# Altium project DDS_RIKEN_2014.PrjPcb
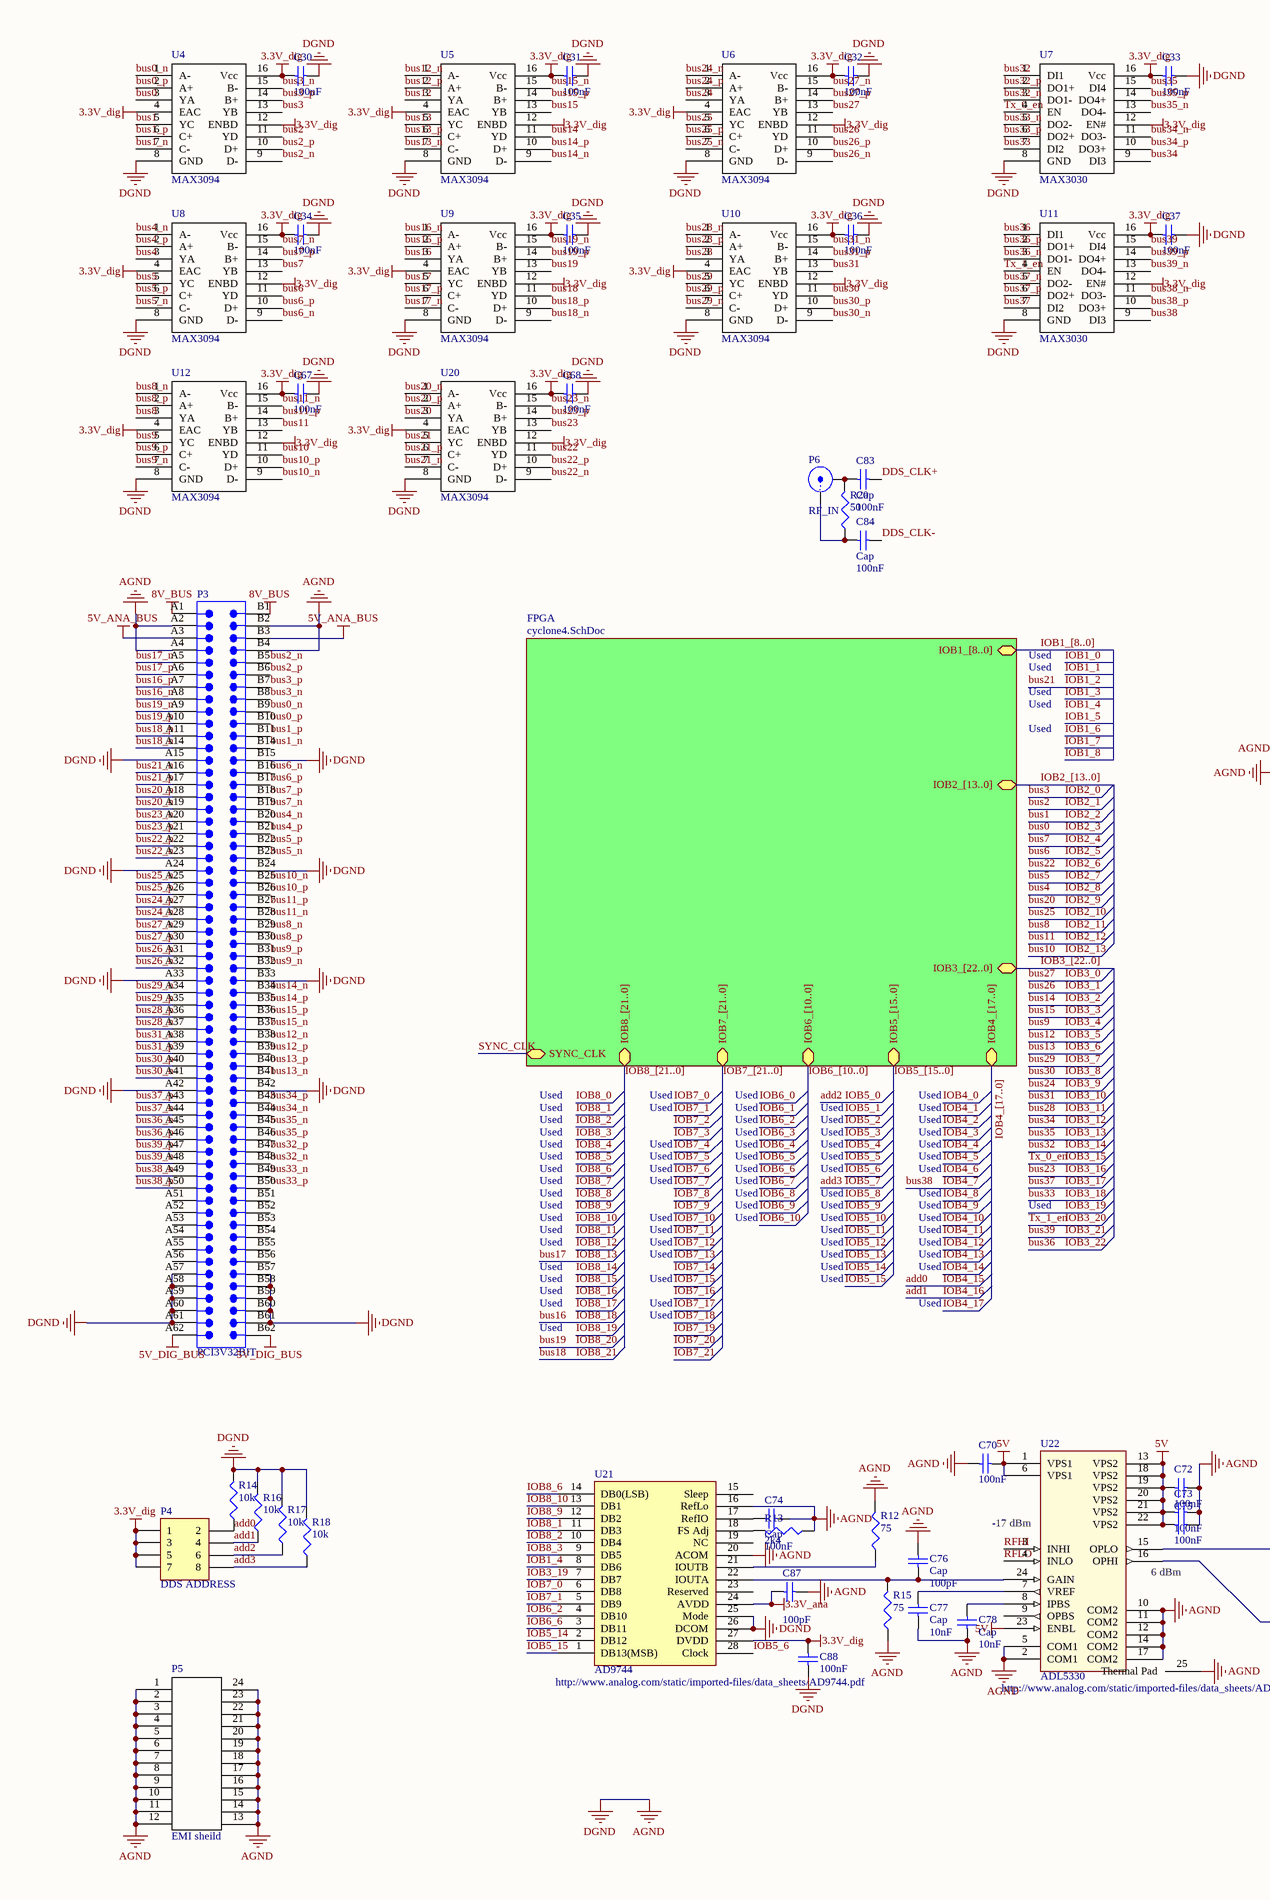
[diagram p0: DDS_RIKEN_main.SchDoc, left]
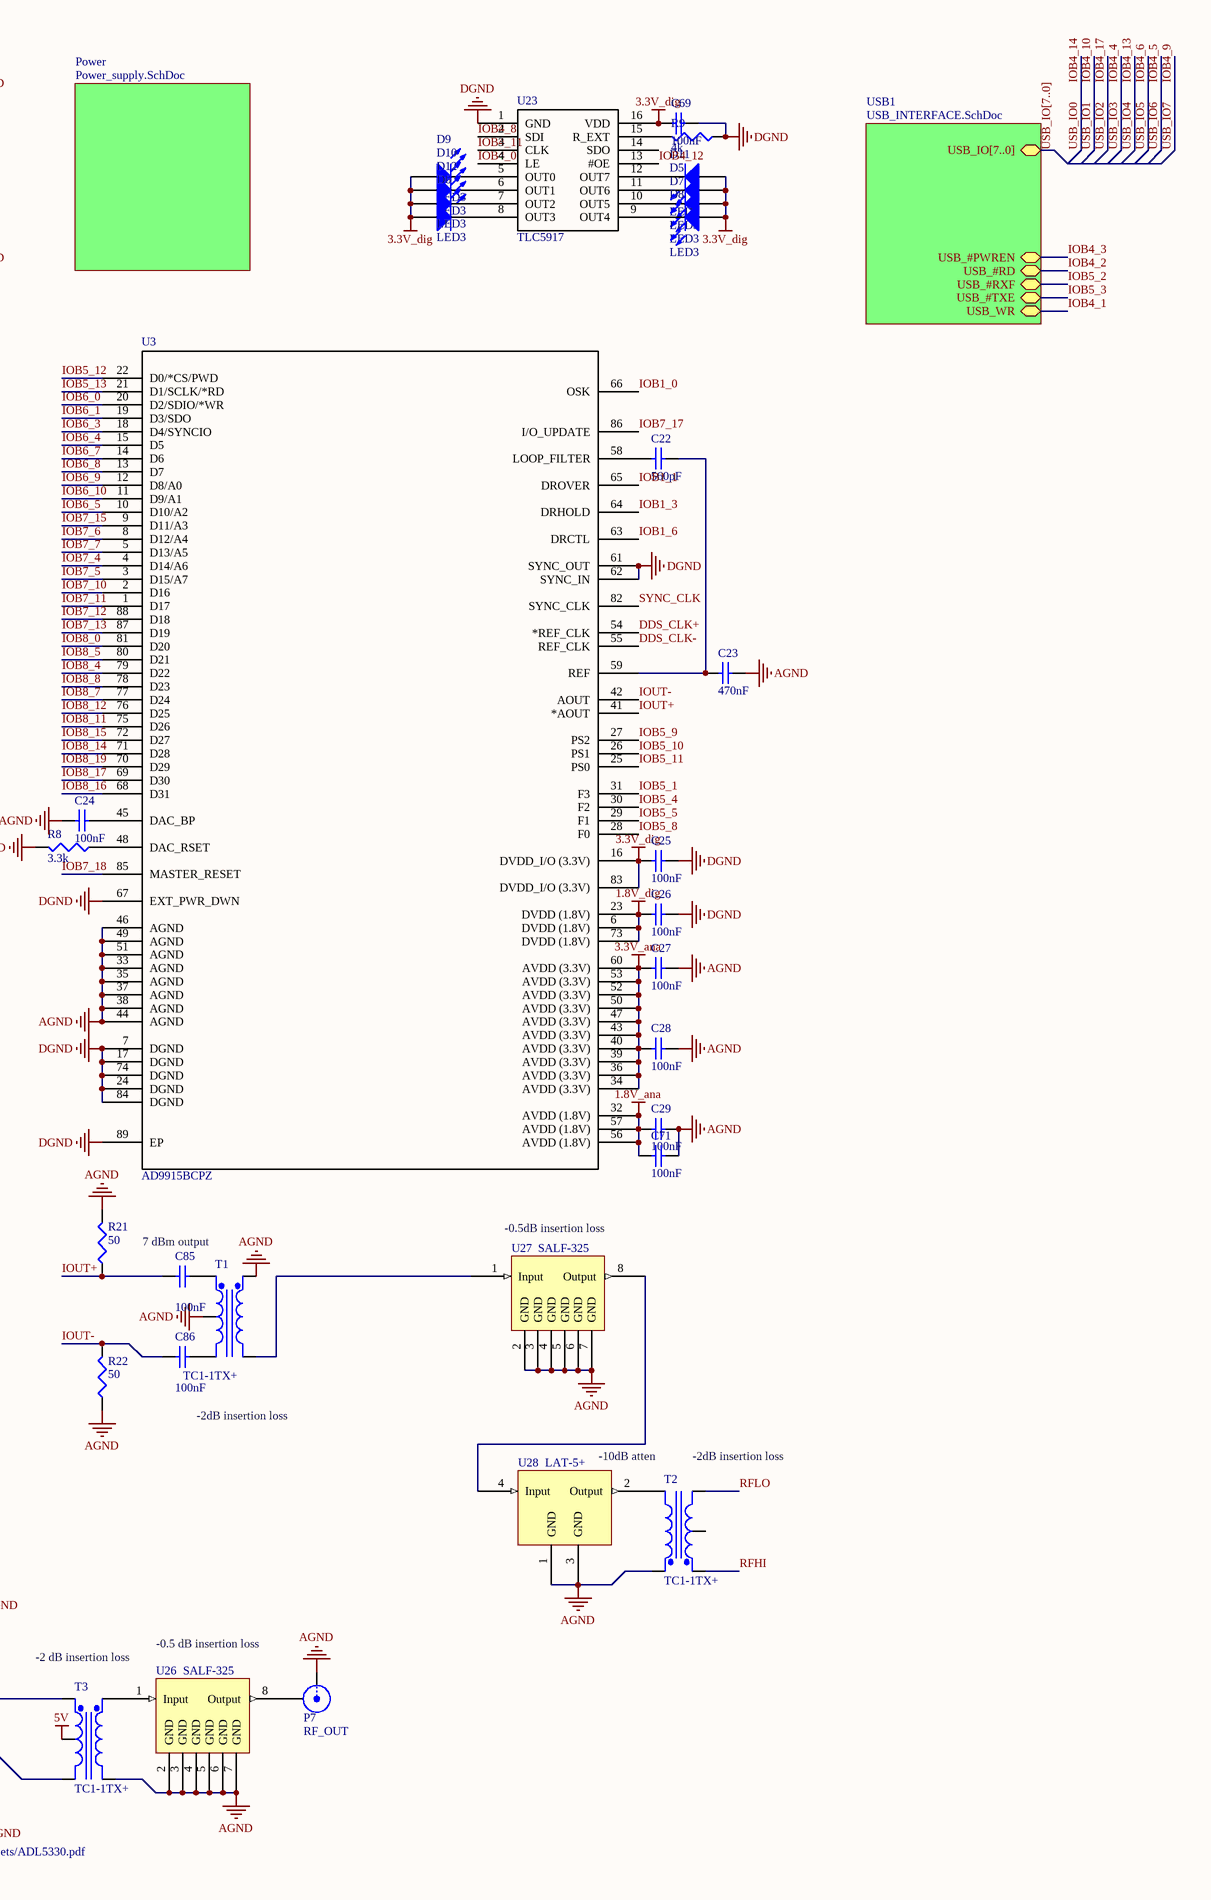
[diagram p1: DDS_RIKEN_main.SchDoc, right]
3 sheets, 159 parts. Net scope: hierarchical (ports join the sheet entries above them; power ports are global).
Board file: DDS_RIKEN_2014.PcbDoc
Sheets:
  DDS_RIKEN_main.SchDoc
    FPGA = cyclone4.SchDoc
    Power = Power_supply.SchDoc

## Sheet DDS_RIKEN_main.SchDoc
size 508 x 406 mm

### Parts
C22  value 560pF  [CAPC2012L]  (hidden comment: Cap Semi)
C23  value 470nF  [CAPC2012L]  (hidden comment: Cap Semi)
C24  value 100nF  [CAPC2012L]  (hidden comment: Cap Semi)
C25  value 100nF  [CAPC2012L]  (hidden comment: Cap Semi)
C26  value 100nF  [CAPC2012L]  (hidden comment: Cap Semi)
C27  value 100nF  [CAPC2012L]  (hidden comment: Cap Semi)
C28  value 100nF  [CAPC2012L]  (hidden comment: Cap Semi)
C29  value 100nF  [CAPC2012L]  (hidden comment: Cap Semi)
C30  value 100nF  [CAPC2012L]  (hidden comment: Cap Semi)
C31  value 100nF  [CAPC2012L]  (hidden comment: Cap Semi)
C32  value 100nF  [CAPC2012L]  (hidden comment: Cap Semi)
C33  value 100nF  [CAPC2012L]  (hidden comment: Cap Semi)
C34  value 100nF  [CAPC2012L]  (hidden comment: Cap Semi)
C35  value 100nF  [CAPC2012L]  (hidden comment: Cap Semi)
C36  value 100nF  [CAPC2012L]  (hidden comment: Cap Semi)
C37  value 100nF  [CAPC2012L]  (hidden comment: Cap Semi)
C67  value 100nF  [CAPC2012L]  (hidden comment: Cap Semi)
C68  value 100nF  [CAPC2012L]  (hidden comment: Cap Semi)
C69  value 100nF  [CAPC2012L]  (hidden comment: Cap Semi)
C70  value 100nF  [CAPC2012L]  (hidden comment: Cap Semi)
C71  value 100nF  [CAPC2012L]  (hidden comment: Cap Semi)
C72  value 100nF  [CAPC2012L]  (hidden comment: Cap Semi)
C73  value 100nF  [CAPC2012L]  (hidden comment: Cap Semi)
C74  Cap  value 100nF  [c0805]
C75  value 100nF  [CAPC2012L]  (hidden comment: Cap Semi)
C76  Cap  value 100pF  [c0805]
C77  Cap  value 10nF  [c0805]
C78  Cap  value 10nF  [c0805]
C83  Cap  value 100nF  [c0805]
C84  Cap  value 100nF  [c0805]
C85  value 100nF  [c0805]  (hidden comment: Cap)
C86  value 100nF  [c0805]  (hidden comment: Cap)
C87  value 100pF  [c0805]  (hidden comment: Cap)
C88  value 100nF  [c0805]  (hidden comment: Cap)
D5  LED3  [DSO-C2/D5.6]
D6  LED3  [DSO-C2/D5.6]
D7  LED3  [DSO-C2/D5.6]
D8  LED3  [DSO-C2/D5.6]
D9  LED3  [DSO-C2/D5.6]
D10  LED3  [DSO-C2/D5.6]
D11  LED3  [DSO-C2/D5.6]
D12  LED3  [DSO-C2/D5.6]
P3  PCI3V32BIT  [PCI3V32BIT]
P4  DDS ADDRESS  [HDR2X4]
P5  EMI sheild  [BMIS-207]
P6  RF_IN  [SMA_Edgecon_31milthick]
P7  RF_OUT  [SMA_Edgecon_31milthick]
R8  value 3.3k  [RESC3216L]
R9  value 4k  [RESC3216L]
R12  value 75  [RESC3216L]
R13  value 2k4  [RESC3216L]
R14  value 10k  [RESC3216L]
R15  value 75  [RESC3216L]
R16  value 10k  [RESC3216L]
R17  value 10k  [RESC3216L]
R18  value 10k  [RESC3216L]
R20  value 50  [RESC3216L]
R21  value 50  [RESC3216L]
R22  value 50  [RESC3216L]
T1  TC1-1TX+  [TC1-1T+]
T2  TC1-1TX+  [TC1-1T+]
T3  TC1-1TX+  [TC1-1T+]
U3  AD9915BCPZ  [CP_88_5]
U4  MAX3094  [TSSOP16]
U5  MAX3094  [TSSOP16]
U6  MAX3094  [TSSOP16]
U7  MAX3030  [TSSOP16]
U8  MAX3094  [TSSOP16]
U9  MAX3094  [TSSOP16]
U10  MAX3094  [TSSOP16]
U11  MAX3030  [TSSOP16]
U12  MAX3094  [TSSOP16]
U20  MAX3094  [TSSOP16]
U21  AD9744  [TSOP65P640-28AM]
U22  ADL5330  [QFN50P400X400-24VAN]
U23  TLC5917  [D016_N]
U26  SALF-325  [SALF-325]
U27  SALF-325  [SALF-325]
U28  LAT-5+  [LAT-10+]

### Sub-sheets
FPGA = cyclone4.SchDoc: IOB1_[8..0], IOB2_[13..0], IOB3_[22..0], IOB4_[17..0], IOB5_[15..0], IOB6_[10..0], IOB7_[21..0], IOB8_[21..0], SYNC_CLK
Power = Power_supply.SchDoc: no entries
USB1 = USB_INTERFACE.SchDoc (file not in this document): USB_IO[7..0], USB_#PWREN, USB_#RD, USB_#RXF, USB_#TXE, USB_WR

### Nets
1.8V_ana: C29.1 C71.1 U3.32(AVDD_(1.8V)) U3.56(AVDD_(1.8V)) U3.57(AVDD_(1.8V))
1.8V_dig: C26.1 U3.6(DVDD_(1.8V)) U3.23(DVDD_(1.8V)) U3.73(DVDD_(1.8V))
3.3V_ana: C27.1 C28.1 C87.2 U3.34(AVDD_(3.3V)) U3.36(AVDD_(3.3V)) U3.39(AVDD_(3.3V)) U3.40(AVDD_(3.3V)) U3.43(AVDD_(3.3V)) U3.47(AVDD_(3.3V)) U3.50(AVDD_(3.3V)) U3.52(AVDD_(3.3V)) U3.53(AVDD_(3.3V)) U3.60(AVDD_(3.3V)) U21.24(AVDD)
3.3V_dig: C25.1 C30.1 C31.1 C32.1 C33.1 C34.1 C35.1 C36.1 C37.1 C67.1 C68.1 C69.1 C88.1 D5.1(A) D6.1(A) D7.1(A) D8.1(A) D9.1(A) D10.1(A) D11.1(A) D12.1(A) P4.1 P4.3 P4.5 P4.7 U3.16(DVDD_I/O_(3.3V)) U3.83(DVDD_I/O_(3.3V)) U4.4(EAC) U4.12(ENBD) U4.16(Vcc) U5.4(EAC) U5.12(ENBD) U5.16(Vcc) U6.4(EAC) U6.12(ENBD) U6.16(Vcc) U7.12(EN#) U7.16(Vcc) U8.4(EAC) U8.12(ENBD) U8.16(Vcc) U9.4(EAC) U9.12(ENBD) U9.16(Vcc) U10.4(EAC) U10.12(ENBD) U10.16(Vcc) U11.12(EN#) U11.16(Vcc) U12.4(EAC) U12.12(ENBD) U12.16(Vcc) U20.4(EAC) U20.12(ENBD) U20.16(Vcc) U21.27(DVDD) U23.16(VDD)
5V: C70.2 C72.1 C73.1 C75.1 T3.2(SecCT) U22.1(VPS1) U22.6(VPS1) U22.13(VPS2) U22.18(VPS2) U22.19(VPS2) U22.20(VPS2) U22.21(VPS2) U22.22(VPS2) U22.23(ENBL)
5V_ANA_BUS: P3.A3 P3.B3
5V_DIG_BUS: P3.A62 P3.B62
8V_BUS: P3.A1 P3.B1
AGND: C23.2 C24.1 C25.2 C26.2 C27.2 C28.2 C29.2 C30.2 C31.2 C32.2 C33.2 C34.2 C35.2 C36.2 C37.2 C67.2 C68.2 C69.2 C70.1 C71.2 C72.2 C73.2 C74.1 C75.2 C76.2 C77.1 C78.1 C87.1 C88.2 P3.A2 P3.A4 P3.A15 P3.A24 P3.A33 P3.A42 P3.A57 P3.A58 P3.A59 P3.A60 P3.A61 P3.B2 P3.B4 P3.B15 P3.B24 P3.B33 P3.B42 P3.B57 P3.B58 P3.B59 P3.B60 P3.B61 P5.1 P5.2(A10) P5.3(A11) P5.4(A12) P5.5(A13) P5.6(A14) P5.7(A15) P5.8(A16) P5.9(A17) P5.10(A18) P5.11(A26) P5.12(A25) P5.13(A23) P5.14(A24) P5.15(A22) P5.16(A19) P5.17(A20) P5.18(A21) P5.19(A8) P5.20(A7) P5.21(A6) P5.22(A5) P5.23(A4) P5.24(A3) P7.1(X) R8.2 R9.1 R12.2 R13.1 R14.2 R15.1 R16.2 R17.2 R18.2 R21.2 R22.1 T1.2(SecCT) T1.6(Pri+) T2.6(Pri+) T3.4(Pri-) U3.7(DGND) U3.17(DGND) U3.24(DGND) U3.33(AGND) U3.35(AGND) U3.37(AGND) U3.38(AGND) U3.44(AGND) U3.46(AGND) U3.49(AGND) U3.51(AGND) U3.61(SYNC_OUT) U3.62(SYNC_IN) U3.67(EXT_PWR_DWN) U3.74(DGND) U3.84(DGND) U3.89(EP) U4.8(GND) U5.8(GND) U6.8(GND) U7.8(GND) U8.8(GND) U9.8(GND) U10.8(GND) U11.8(GND) U12.8(GND) U20.8(GND) U21.16(RefLo) U21.20(ACOM) U21.25(Mode) U21.26(DCOM) U22.2(COM1) U22.5(COM1) U22.10(COM2) U22.11(COM2) U22.12(COM2) U22.14(COM2) U22.17(COM2) U22.25(Thermal_Pad) U23.1(GND) U26.2(GND) U26.3(GND) U26.4(GND) U26.5(GND) U26.6(GND) U26.7(GND) U27.2(GND) U27.3(GND) U27.4(GND) U27.5(GND) U27.6(GND) U27.7(GND) U28.1(GND) U28.3(GND)  [also labelled DGND]
add0: P4.2 R14.1  [also labelled IOB4_15]
add1: P4.4 R16.1  [also labelled IOB4_16]
add2: P4.6 R17.1  [also labelled IOB5_0]
add3: P4.8 R18.1  [also labelled IOB5_7]
bus0: U4.3(YA)  [also labelled IOB2_3]
bus0_n: P3.B9 U4.1(A-)
bus0_p: P3.B10 U4.2(A+)
bus1: U4.5(YC)  [also labelled IOB2_2]
bus1_n: P3.B14 U4.7(C-)
bus1_p: P3.B11 U4.6(C+)
bus2: U4.11(YD)  [also labelled IOB2_1]
bus2_n: P3.B5 U4.9(D-)
bus2_p: P3.B6 U4.10(D+)
bus3: U4.13(YB)  [also labelled IOB2_0]
bus3_n: P3.B8 U4.15(B-)
bus3_p: P3.B7 U4.14(B+)
bus4: U8.3(YA)  [also labelled IOB2_8]
bus4_n: P3.B20 U8.1(A-)
bus4_p: P3.B21 U8.2(A+)
bus5: U8.5(YC)  [also labelled IOB2_7]
bus5_n: P3.B23 U8.7(C-)
bus5_p: P3.B22 U8.6(C+)
bus6: U8.11(YD)  [also labelled IOB2_5]
bus6_n: P3.B16 U8.9(D-)
bus6_p: P3.B17 U8.10(D+)
bus7: U8.13(YB)  [also labelled IOB2_4]
bus7_n: P3.B19 U8.15(B-)
bus7_p: P3.B18 U8.14(B+)
bus8: U12.3(YA)  [also labelled IOB2_11]
bus8_n: P3.B29 U12.1(A-)
bus8_p: P3.B30 U12.2(A+)
bus9: U12.5(YC)  [also labelled IOB3_4]
bus9_n: P3.B32 U12.7(C-)
bus9_p: P3.B31 U12.6(C+)
bus10: U12.11(YD)  [also labelled IOB2_13]
bus10_n: P3.B25 U12.9(D-)
bus10_p: P3.B26 U12.10(D+)
bus11: U12.13(YB)  [also labelled IOB2_12]
bus11_n: P3.B28 U12.15(B-)
bus11_p: P3.B27 U12.14(B+)
bus12: U5.3(YA)  [also labelled IOB3_5]
bus12_n: P3.B38 U5.1(A-)
bus12_p: P3.B39 U5.2(A+)
bus13: U5.5(YC)  [also labelled IOB3_6]
bus13_n: P3.B41 U5.7(C-)
bus13_p: P3.B40 U5.6(C+)
bus14: U5.11(YD)  [also labelled IOB3_2]
bus14_n: P3.B34 U5.9(D-)
bus14_p: P3.B35 U5.10(D+)
bus15: U5.13(YB)  [also labelled IOB3_3]
bus15_n: P3.B37 U5.15(B-)
bus15_p: P3.B36 U5.14(B+)
bus16: U9.3(YA)  [also labelled IOB8_18]
bus16_n: P3.A8 U9.1(A-)
bus16_p: P3.A7 U9.2(A+)
bus17: U9.5(YC)  [also labelled IOB8_13]
bus17_n: P3.A5 U9.7(C-)
bus17_p: P3.A6 U9.6(C+)
bus18: U9.11(YD)  [also labelled IOB8_21]
bus18_n: P3.A14 U9.9(D-)
bus18_p: P3.A11 U9.10(D+)
bus19: U9.13(YB)  [also labelled IOB8_20]
bus19_n: P3.A9 U9.15(B-)
bus19_p: P3.A10 U9.14(B+)
bus20: U20.3(YA)  [also labelled IOB2_9]
bus20_n: P3.A19 U20.1(A-)
bus20_p: P3.A18 U20.2(A+)
bus21: U20.5(YC)  [also labelled IOB1_2]
bus21_n: P3.A16 U20.7(C-)
bus21_p: P3.A17 U20.6(C+)
bus22: U20.11(YD)  [also labelled IOB2_6]
bus22_n: P3.A23 U20.9(D-)
bus22_p: P3.A22 U20.10(D+)
bus23: U20.13(YB)  [also labelled IOB3_16]
bus23_n: P3.A20 U20.15(B-)
bus23_p: P3.A21 U20.14(B+)
bus24: U6.3(YA)  [also labelled IOB3_9]
bus24_n: P3.A28 U6.1(A-)
bus24_p: P3.A27 U6.2(A+)
bus25: U6.5(YC)  [also labelled IOB2_10]
bus25_n: P3.A25 U6.7(C-)
bus25_p: P3.A26 U6.6(C+)
bus26: U6.11(YD)  [also labelled IOB3_1]
bus26_n: P3.A32 U6.9(D-)
bus26_p: P3.A31 U6.10(D+)
bus27: U6.13(YB)  [also labelled IOB3_0]
bus27_n: P3.A29 U6.15(B-)
bus27_p: P3.A30 U6.14(B+)
bus28: U10.3(YA)  [also labelled IOB3_11]
bus28_n: P3.A37 U10.1(A-)
bus28_p: P3.A36 U10.2(A+)
bus29: U10.5(YC)  [also labelled IOB3_7]
bus29_n: P3.A34 U10.7(C-)
bus29_p: P3.A35 U10.6(C+)
bus30: U10.11(YD)  [also labelled IOB3_8]
bus30_n: P3.A41 U10.9(D-)
bus30_p: P3.A40 U10.10(D+)
bus31: U10.13(YB)  [also labelled IOB3_10]
bus31_n: P3.A38 U10.15(B-)
bus31_p: P3.A39 U10.14(B+)
bus32: U7.1(DI1)  [also labelled IOB3_14]
bus32_n: P3.B48 U7.3(DO1-)
bus32_p: P3.B47 U7.2(DO1+)
bus33: U7.7(DI2)  [also labelled IOB3_18]
bus33_n: P3.B49 U7.5(DO2-)
bus33_p: P3.B50 U7.6(DO2+)
bus34: U7.9(DI3)  [also labelled IOB3_12]
bus34_n: P3.B44 U7.11(DO3-)
bus34_p: P3.B43 U7.10(DO3+)
bus35: U7.15(DI4)  [also labelled IOB3_13]
bus35_n: P3.B45 U7.13(DO4-)
bus35_p: P3.B46 U7.14(DO4+)
bus36: U11.1(DI1)  [also labelled IOB3_22]
bus36_n: P3.A45 U11.3(DO1-)
bus36_p: P3.A46 U11.2(DO1+)
bus37: U11.7(DI2)  [also labelled IOB3_17]
bus37_n: P3.A44 U11.5(DO2-)
bus37_p: P3.A43 U11.6(DO2+)
bus38: U11.9(DI3)  [also labelled IOB4_7]
bus38_n: P3.A49 U11.11(DO3-)
bus38_p: P3.A50 U11.10(DO3+)
bus39: U11.15(DI4)  [also labelled IOB3_21]
bus39_n: P3.A48 U11.13(DO4-)
bus39_p: P3.A47 U11.14(DO4+)
DDS_CLK+: C83.1 U3.54(*REF_CLK)
DDS_CLK-: C84.1 U3.55(REF_CLK)
IOB1_0: U3.66(OSK)
IOB1_1: U3.65(DROVER)
IOB1_3: U3.64(DRHOLD)
IOB1_4: U21.8(DB6)
IOB1_6: U3.63(DRCTL)
IOB3_15: U7.4(EN)  [also labelled Tx_0_en]
IOB3_19: U21.7(DB7)
IOB3_20: U11.4(EN)  [also labelled Tx_1_en]
IOB4_0: U23.4(LE)
IOB4_8: U23.2(SDI)
IOB4_11: U23.3(CLK)
IOB4_12: U23.13(#OE)
IOB5_1: U3.31(F3)
IOB5_4: U3.30(F2)
IOB5_5: U3.29(F1)
IOB5_6: U21.28(Clock)
IOB5_8: U3.28(F0)
IOB5_9: U3.27(PS2)
IOB5_10: U3.26(PS1)
IOB5_11: U3.25(PS0)
IOB5_12: U3.22(D0/*CS/PWD)
IOB5_13: U3.21(D1/SCLK/*RD)
IOB5_14: U21.2(DB12)
IOB5_15: U21.1(DB13(MSB))
IOB6_0: U3.20(D2/SDIO/*WR)
IOB6_1: U3.19(D3/SDO)
IOB6_2: U21.4(DB10)
IOB6_3: U3.18(D4/SYNCIO)
IOB6_4: U3.15(D5)
IOB6_5: U3.10(D10/A2)
IOB6_6: U21.3(DB11)
IOB6_7: U3.14(D6)
IOB6_8: U3.13(D7)
IOB6_9: U3.12(D8/A0)
IOB6_10: U3.11(D9/A1)
IOB7_0: U21.6(DB8)
IOB7_1: U21.5(DB9)
IOB7_4: U3.4(D14/A6)
IOB7_5: U3.3(D15/A7)
IOB7_6: U3.8(D12/A4)
IOB7_7: U3.5(D13/A5)
IOB7_10: U3.2(D16)
IOB7_11: U3.1(D17)
IOB7_12: U3.88(D18)
IOB7_13: U3.87(D19)
IOB7_15: U3.9(D11/A3)
IOB7_17: U3.86(I/O_UPDATE)
IOB7_18: U3.85(MASTER_RESET)
IOB8_0: U3.81(D20)
IOB8_1: U21.11(DB3)
IOB8_2: U21.10(DB4)
IOB8_3: U21.9(DB5)
IOB8_4: U3.79(D22)
IOB8_5: U3.80(D21)
IOB8_6: U21.14(DB0(LSB))
IOB8_7: U3.77(D24)
IOB8_8: U3.78(D23)
IOB8_9: U21.12(DB2)
IOB8_10: U21.13(DB1)
IOB8_11: U3.75(D26)
IOB8_12: U3.76(D25)
IOB8_14: U3.71(D28)
IOB8_15: U3.72(D27)
IOB8_16: U3.68(D31)
IOB8_17: U3.69(D30)
IOB8_19: U3.70(D29)
IOUT+: C85.2 R21.1 U3.41(*AOUT)
IOUT-: C86.2 R22.2 U3.42(AOUT)
RFHI: T2.3(Sec+) U22.3(INHI)
RFLO: T2.1(Sec-) U22.4(INLO)
SYNC_CLK: U3.82(SYNC_CLK) ; sheet FPGA/SYNC_CLK
NetC22_1: C22.1 U3.58(LOOP_FILTER)
NetC22_2: C22.2 C23.1 U3.59(REF)
NetC24_2: C24.2 U3.45(DAC_BP)
NetC74_2: C74.2 U21.17(RefIO)
NetC76_1: C76.1 R15.2 U21.22(IOUTA) U22.24(GAIN)
NetC77_2: C77.2 U22.7(VREF)
NetC78_2: C78.2 U22.8(IPBS)
NetC83_2: C83.2 P6.2(Y) R20.2
NetC84_2: C84.2 P6.1(X) R20.1
NetC85_1: C85.1 T1.3(Sec+)
NetC86_1: C86.1 T1.1(Sec-)
NetD5_2: D5.2(K) U23.11(OUT6)
NetD6_2: D6.2(K) U23.8(OUT3)
NetD7_2: D7.2(K) U23.10(OUT5)
NetD8_2: D8.2(K) U23.9(OUT4)
NetD9_2: D9.2(K) U23.5(OUT0)
NetD10_2: D10.2(K) U23.6(OUT1)
NetD11_2: D11.2(K) U23.12(OUT7)
NetD12_2: D12.2(K) U23.7(OUT2)
NetP7_2: P7.2(Y) U26.8(Output)
NetR8_1: R8.1 U3.48(DAC_RSET)
NetR9_2: R9.2 U23.15(R_EXT)
NetR12_1: R12.1 U21.21(IOUTB)
NetR13_2: R13.2 U21.18(FS_Adj)
NetT1_4: T1.4(Pri-) U27.1(Input)
NetT2_4: T2.4(Pri-) U28.2(Output)
NetT3_1: T3.1(Sec-) U22.16(OPHI)
NetT3_3: T3.3(Sec+) U22.15(OPLO)
NetT3_6: T3.6(Pri+) U26.1(Input)
NetU27_8: U27.8(Output) U28.4(Input)

Not connected (* = marked no-connect by the designer): P3 A51 A52 A53 A54 A55 A56 B51 B52 B53 B54 B55 B56; T2 2(SecCT); U21 15(Sleep) 19(NC) 23(Reserved); U22 9(OPBS); U23 14(SDO)

### Buses and harness runs
bus IOB1_[8..0] = sheet FPGA/IOB1_[8..0]
bus IOB2_[13..0] = sheet FPGA/IOB2_[13..0]
bus IOB3_[22..0] = sheet FPGA/IOB3_[22..0]
bus IOB4_[17..0] = sheet FPGA/IOB4_[17..0]
bus IOB5_[15..0] = sheet FPGA/IOB5_[15..0]
bus IOB6_[10..0] = sheet FPGA/IOB6_[10..0]
bus IOB7_[21..0] = sheet FPGA/IOB7_[21..0]
bus IOB8_[21..0] = sheet FPGA/IOB8_[21..0]
bus USB_IO[7..0] = sheet USB1/USB_IO[7..0]

### Notes on the sheet
- Used
- (near U27) -0.5dB insertion loss
- 7 dBm output
- -2dB insertion loss
- -10dB atten
- (near T2) -2dB insertion loss
- (near U22) -17 dBm
- -2 dB insertion loss
- -0.5 dB insertion loss
- (near U22) 6 dBm
- Labels drawn without touching a wire or pin: IOB1_4

### Library data of the parts
C22-C37 C67-C73 C75 = Cap Semi: Capacitor (Semiconductor SIM Model); Published: 8-Jun-2000; LatestRevisionDate: 29-May-2009; LatestRevisionNote: IPC-7351 Footprint Added.; PackageReference: C1206; Publisher: Altium Limited; PackageDescription: Chip Capacitor
C74 C76-C78 C83-C88 = Cap: Capacitor; Voltage: 16V; Published: 8-Jun-2000; LatestRevisionDate: 17-Jul-2002; LatestRevisionNote: Re-released for DXP Platform.; PackageReference: RAD-0.3; Publisher: Altium Limited
D5-D12 = LED3: Typical BLUE SiC LED; Published: 8-Jun-2000; LatestRevisionDate: 17-Dec-2003; LatestRevisionNote: PCB Footprint replaced.; DatasheetVersion: 16-Apr-2002; PackageVersion: 16-Apr-2002; PackageReference: 3.5X2.8X1.9; Publisher: Altium Limited
P3 = PCI3V32BIT: Card, 120-Position; Text Field6: Pins A12, A13, B12 & B13 are not present.  Alternate Layout Available; Text Field7: Published 14-Feb-2002
P4 = Header 4X2: Header, 4-Pin, Dual row; LatestRevisionDate: 17-Jul-2002; LatestRevisionNote: Re-released for DXP Platform.; Publisher: Altium Limited
P5 = BMIS-207: Laird Shield; LatestRevisionDate: 17-Jul-2002; LatestRevisionNote: Re-released for DXP Platform.; Publisher: Altium Limited
P6 P7 = SMB: SMA Straight Connector; pin to pad: 1>2 2>1; LatestRevisionDate: 17-Jul-2002; LatestRevisionNote: Re-released for DXP Platform.; Publisher: Altium Limited
R8 R9 R12-R18 R20-R22 = Res3: Resistor; Published: 8-Jun-2000; LatestRevisionDate: 29-May-2009; LatestRevisionNote: IPC-7351 Footprint Added.; PackageReference: J1-0603; Publisher: Altium Limited; PackageDescription: Chip Resistor
T1-T3 = Trans CT: Center-Tapped Transformer (Coupled Inductor Model); Published: 8-Jun-2000; LatestRevisionDate: 17-Jul-2002; LatestRevisionNote: Re-released for DXP Platform.; PackageReference: TRF_5; Publisher: Altium Limited
U3 = AD9915BCPZ: Imported; RefDes: RefDes; Type: DEV; Value: Value
U4-U6 U8-U10 U12 U20 = MAX3094: Differential Line Receivers
U7 U11 = MAX3030: Differential Line Transmitter
U22 = ADL5330: analoger Abschwächer; HelpURL: http://www.analog.com/static/imported-files/data_sheets/ADL5330.pdf
U23 = TLC5917: 8-bit LED driver (Serial)
U28 = LAT-30+
U21 = AD9744: HelpURL: http://www.analog.com/static/imported-files/data_sheets/AD9744.pdf

## Sheet cyclone4.SchDoc
size 355 x 398 mm
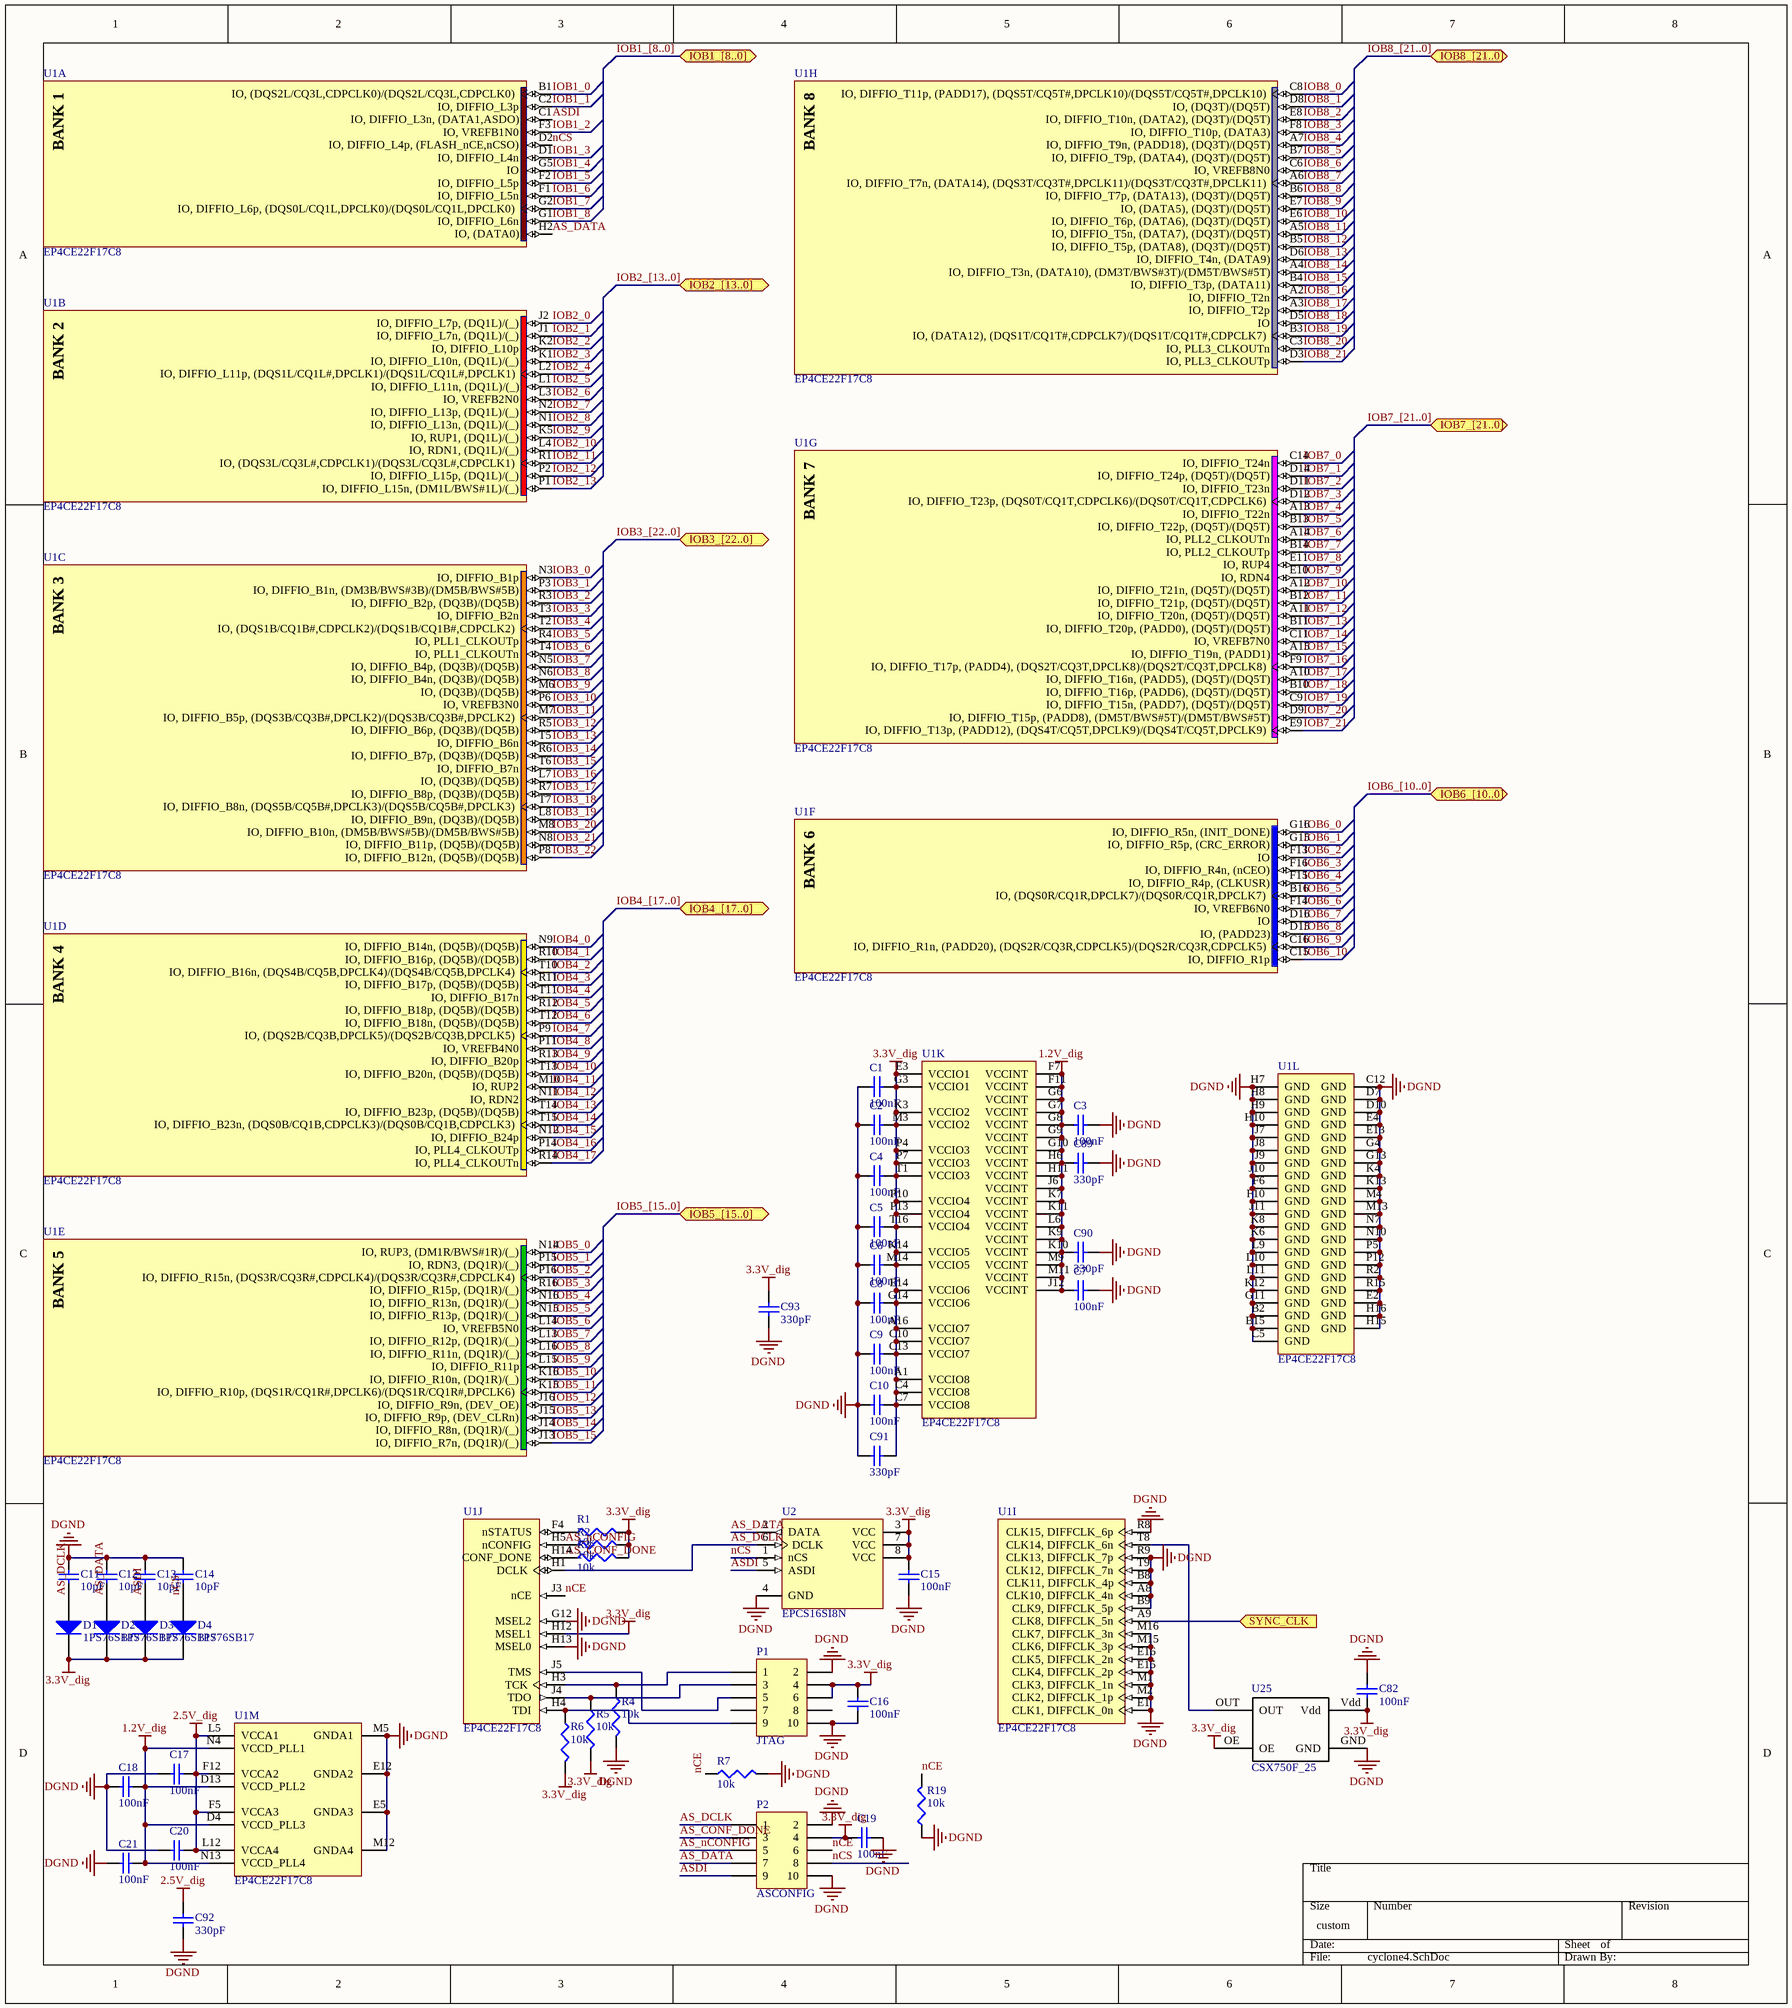
[diagram p2: cyclone4.SchDoc]

### Parts
C1  value 100nF  [CAPC2012L]  (hidden comment: Cap Semi)
C2  value 100nF  [CAPC2012L]  (hidden comment: Cap Semi)
C3  value 100nF  [CAPC2012L]  (hidden comment: Cap Semi)
C4  value 100nF  [CAPC2012L]  (hidden comment: Cap Semi)
C5  value 100nF  [CAPC2012L]  (hidden comment: Cap Semi)
C6  value 100nF  [CAPC2012L]  (hidden comment: Cap Semi)
C7  value 100nF  [CAPC2012L]  (hidden comment: Cap Semi)
C8  value 100nF  [CAPC2012L]  (hidden comment: Cap Semi)
C9  value 100nF  [CAPC2012L]  (hidden comment: Cap Semi)
C10  value 100nF  [CAPC2012L]  (hidden comment: Cap Semi)
C11  value 10pF  [CAPC2012L]  (hidden comment: Cap Semi)
C12  value 10pF  [CAPC2012L]  (hidden comment: Cap Semi)
C13  value 10pF  [CAPC2012L]  (hidden comment: Cap Semi)
C14  value 10pF  [CAPC2012L]  (hidden comment: Cap Semi)
C15  value 100nF  [CAPC2012L]  (hidden comment: Cap Semi)
C16  value 100nF  [CAPC2012L]  (hidden comment: Cap Semi)
C17  value 100nF  [CAPC2012L]  (hidden comment: Cap Semi)
C18  value 100nF  [CAPC2012L]  (hidden comment: Cap Semi)
C19  value 100nF  [CAPC2012L]  (hidden comment: Cap Semi)
C20  value 100nF  [CAPC2012L]  (hidden comment: Cap Semi)
C21  value 100nF  [CAPC2012L]  (hidden comment: Cap Semi)
C82  value 100nF  [CAPC2012L]  (hidden comment: Cap Semi)
C89  value 330pF  [CAPC2012L]  (hidden comment: Cap Semi)
C90  value 330pF  [CAPC2012L]  (hidden comment: Cap Semi)
C91  value 330pF  [CAPC2012L]  (hidden comment: Cap Semi)
C92  value 330pF  [CAPC2012L]  (hidden comment: Cap Semi)
C93  value 330pF  [CAPC2012L]  (hidden comment: Cap Semi)
D1  1PS76SB17  [SOD323]
D2  1PS76SB17  [SOD323]
D3  1PS76SB17  [SOD323]
D4  1PS76SB17  [SOD323]
P1  JTAG  [HDR2X5]
P2  ASCONFIG  [HDR2X5]
R1  value 10k  [RESC3216L]
R2  value 10k  [RESC3216L]
R3  value 10k  [RESC3216L]
R4  value 10k  [RESC3216L]
R5  value 10k  [RESC3216L]
R6  value 10k  [RESC3216L]
R7  value 10k  [RESC3216L]
R19  value 10k  [RESC3216L]
U1  EP4CE22F17C8  [FBGA256]  (parts A,B,C,D,E,F,G,H,I,J,K,L,M of 13)
U2  EPCS16SI8N  [SOIC8_L]
U25  CSX750F_25  [CSX750F]

### Ports
IOB1_[8..0] (bidir), IOB2_[13..0] (bidir), IOB3_[22..0] (bidir), IOB4_[17..0] (bidir), IOB5_[15..0] (bidir), IOB6_[10..0] (bidir), IOB7_[21..0] (bidir), IOB8_[21..0] (bidir), SYNC_CLK (in)

### Nets
1.2V_dig: C3.1 C7.1 C18.2 C21.2 C89.1 C90.1 U1.D4(VCCD_PLL3) U1.D13(VCCD_PLL2) U1.F7(VCCINT) U1.F11(VCCINT) U1.G6(VCCINT) U1.G7(VCCINT) U1.G8(VCCINT) U1.G9(VCCINT) U1.G10(VCCINT) U1.H6(VCCINT) U1.H11(VCCINT) U1.J6(VCCINT) U1.J12(VCCINT) U1.K7(VCCINT) U1.K9(VCCINT) U1.K10(VCCINT) U1.K11(VCCINT) U1.L6(VCCINT) U1.M9(VCCINT) U1.M11(VCCINT) U1.N4(VCCD_PLL1) U1.N13(VCCD_PLL4)
2.5V_dig: C17.2 C20.1 C92.2 U1.F5(VCCA3) U1.F12(VCCA2) U1.L5(VCCA1) U1.L12(VCCA4)
3.3V_dig: C1.2 C2.2 C4.2 C5.2 C6.2 C8.2 C9.2 C10.2 C15.1 C16.1 C19.1 C82.2 C91.2 C93.2 D1.2(K) D2.2(K) D3.2(K) D4.2(K) P1.4 P1.6 P2.4 R1.2 R2.2 R3.2 R5.2 R6.2 U1.A1(VCCIO8) U1.A16(VCCIO7) U1.C4(VCCIO8) U1.C7(VCCIO8) U1.C10(VCCIO7) U1.C13(VCCIO7) U1.E3(VCCIO1) U1.E14(VCCIO6) U1.G3(VCCIO1) U1.G14(VCCIO6) U1.H12(MSEL1) U1.K3(VCCIO2) U1.K14(VCCIO5) U1.M3(VCCIO2) U1.M14(VCCIO5) U1.P4(VCCIO3) U1.P7(VCCIO3) U1.P10(VCCIO4) U1.P13(VCCIO4) U1.T1(VCCIO3) U1.T16(VCCIO4) U2.3(VCC) U2.7(VCC) U2.8(VCC) U25.OE U25.Vdd
DGND: C1.1 C2.1 C3.2 C4.1 C5.1 C6.1 C7.2 C8.1 C9.1 C10.1 C11.2 C12.2 C13.2 C14.2 C15.2 C16.2 C17.1 C18.1 C19.2 C20.2 C21.1 C82.1 C89.2 C90.2 C91.1 C92.1 C93.1 P1.2 P1.10 P2.2 P2.10 R4.2 R7.2 R19.1 U1.A8(CLK10,_DIFFCLK_4n) U1.B2(GND) U1.B8(CLK11,_DIFFCLK_4p) U1.B9(CLK9,_DIFFCLK_5p) U1.B15(GND) U1.C5(GND) U1.C12(GND) U1.D7(GND) U1.D10(GND) U1.E1(CLK1,_DIFFCLK_0n) U1.E2(GND) U1.E4(GND) U1.E5(GNDA3) U1.E12(GNDA2) U1.E13(GND) U1.E15(CLK4,_DIFFCLK_2p) U1.E16(CLK5,_DIFFCLK_2n) U1.F6(GND) U1.F10(GND) U1.G4(GND) U1.G11(GND) U1.G12(MSEL2) U1.G13(GND) U1.H7(GND) U1.H8(GND) U1.H9(GND) U1.H10(GND) U1.H13(MSEL0) U1.H15(GND) U1.H16(GND) U1.J7(GND) U1.J8(GND) U1.J9(GND) U1.J10(GND) U1.J11(GND) U1.K4(GND) U1.K6(GND) U1.K8(GND) U1.K12(GND) U1.K13(GND) U1.L9(GND) U1.L10(GND) U1.L11(GND) U1.M1(CLK3,_DIFFCLK_1n) U1.M2(CLK2,_DIFFCLK_1p) U1.M4(GND) U1.M5(GNDA1) U1.M12(GNDA4) U1.M13(GND) U1.M15(CLK6,_DIFFCLK_3p) U1.M16(CLK7,_DIFFCLK_3n) U1.N7(GND) U1.N10(GND) U1.P5(GND) U1.P12(GND) U1.R2(GND) U1.R8(CLK15,_DIFFCLK_6p) U1.R9(CLK13,_DIFFCLK_7p) U1.R15(GND) U1.T9(CLK12,_DIFFCLK_7n) U2.4(GND) U25.GND  [project net AGND]
AS_CONF_DONE: P2.3 R3.1 U1.H14(CONF_DONE)
AS_DATA: C12.1 D2.1(A) P2.7 U1.H2(IO,_(DATA0)) U2.2(DATA)
AS_DCLK: C11.1 D1.1(A) P2.1 U1.H1(DCLK) U2.6(DCLK)
AS_nCONFIG: P2.5 R2.1 U1.H5(nCONFIG)
ASDI: C13.1 D3.1(A) P2.9 U1.C1(IO,_DIFFIO_L3n,_(DATA1,ASDO)) U2.5(ASDI)
IOB1_0: U1.B1(IO,_(DQS2L/CQ3L,CDPCLK0)/(DQS2L/CQ3L,CDPCLK0))
IOB1_1: U1.C2(IO,_DIFFIO_L3p)
IOB1_2: U1.F3(IO,_VREFB1N0)  [project net bus21]
IOB1_3: U1.D1(IO,_DIFFIO_L4n)
IOB1_4: U1.G5(IO)
IOB1_5: U1.F2(IO,_DIFFIO_L5p)
IOB1_6: U1.F1(IO,_DIFFIO_L5n)
IOB1_7: U1.G2(IO,_DIFFIO_L6p,_(DQS0L/CQ1L,DPCLK0)/(DQS0L/CQ1L,DPCLK0))
IOB1_8: U1.G1(IO,_DIFFIO_L6n)
IOB2_0: U1.J2(IO,_DIFFIO_L7p,_(DQ1L)/(_))  [project net bus3]
IOB2_1: U1.J1(IO,_DIFFIO_L7n,_(DQ1L)/(_))  [project net bus2]
IOB2_2: U1.K2(IO,_DIFFIO_L10p)  [project net bus1]
IOB2_3: U1.K1(IO,_DIFFIO_L10n,_(DQ1L)/(_))  [project net bus0]
IOB2_4: U1.L2(IO,_DIFFIO_L11p,_(DQS1L/CQ1L#,DPCLK1)/(DQS1L/CQ1L#,DPCLK1))  [project net bus7]
IOB2_5: U1.L1(IO,_DIFFIO_L11n,_(DQ1L)/(_))  [project net bus6]
IOB2_6: U1.L3(IO,_VREFB2N0)  [project net bus22]
IOB2_7: U1.N2(IO,_DIFFIO_L13p,_(DQ1L)/(_))  [project net bus5]
IOB2_8: U1.N1(IO,_DIFFIO_L13n,_(DQ1L)/(_))  [project net bus4]
IOB2_9: U1.K5(IO,_RUP1,_(DQ1L)/(_))  [project net bus20]
IOB2_10: U1.L4(IO,_RDN1,_(DQ1L)/(_))  [project net bus25]
IOB2_11: U1.R1(IO,_(DQS3L/CQ3L#,CDPCLK1)/(DQS3L/CQ3L#,CDPCLK1))  [project net bus8]
IOB2_12: U1.P2(IO,_DIFFIO_L15p,_(DQ1L)/(_))  [project net bus11]
IOB2_13: U1.P1(IO,_DIFFIO_L15n,_(DM1L/BWS#1L)/(_))  [project net bus10]
IOB3_0: U1.N3(IO,_DIFFIO_B1p)  [project net bus27]
IOB3_1: U1.P3(IO,_DIFFIO_B1n,_(DM3B/BWS#3B)/(DM5B/BWS#5B))  [project net bus26]
IOB3_2: U1.R3(IO,_DIFFIO_B2p,_(DQ3B)/(DQ5B))  [project net bus14]
IOB3_3: U1.T3(IO,_DIFFIO_B2n)  [project net bus15]
IOB3_4: U1.T2(IO,_(DQS1B/CQ1B#,CDPCLK2)/(DQS1B/CQ1B#,CDPCLK2))  [project net bus9]
IOB3_5: U1.R4(IO,_PLL1_CLKOUTp)  [project net bus12]
IOB3_6: U1.T4(IO,_PLL1_CLKOUTn)  [project net bus13]
IOB3_7: U1.N5(IO,_DIFFIO_B4p,_(DQ3B)/(DQ5B))  [project net bus29]
IOB3_8: U1.N6(IO,_DIFFIO_B4n,_(DQ3B)/(DQ5B))  [project net bus30]
IOB3_9: U1.M6(IO,_(DQ3B)/(DQ5B))  [project net bus24]
IOB3_10: U1.P6(IO,_VREFB3N0)  [project net bus31]
IOB3_11: U1.M7(IO,_DIFFIO_B5p,_(DQS3B/CQ3B#,DPCLK2)/(DQS3B/CQ3B#,DPCLK2))  [project net bus28]
IOB3_12: U1.R5(IO,_DIFFIO_B6p,_(DQ3B)/(DQ5B))  [project net bus34]
IOB3_13: U1.T5(IO,_DIFFIO_B6n)  [project net bus35]
IOB3_14: U1.R6(IO,_DIFFIO_B7p,_(DQ3B)/(DQ5B))  [project net bus32]
IOB3_15: U1.T6(IO,_DIFFIO_B7n)
IOB3_16: U1.L7(IO,_(DQ3B)/(DQ5B))  [project net bus23]
IOB3_17: U1.R7(IO,_DIFFIO_B8p,_(DQ3B)/(DQ5B))  [project net bus37]
IOB3_18: U1.T7(IO,_DIFFIO_B8n,_(DQS5B/CQ5B#,DPCLK3)/(DQS5B/CQ5B#,DPCLK3))  [project net bus33]
IOB3_19: U1.L8(IO,_DIFFIO_B9n,_(DQ3B)/(DQ5B))
IOB3_20: U1.M8(IO,_DIFFIO_B10n,_(DM5B/BWS#5B)/(DM5B/BWS#5B))
IOB3_21: U1.N8(IO,_DIFFIO_B11p,_(DQ5B)/(DQ5B))  [project net bus39]
IOB3_22: U1.P8(IO,_DIFFIO_B12n,_(DQ5B)/(DQ5B))  [project net bus36]
IOB4_0: U1.N9(IO,_DIFFIO_B14n,_(DQ5B)/(DQ5B))
IOB4_1: U1.R10(IO,_DIFFIO_B16p,_(DQ5B)/(DQ5B))
IOB4_2: U1.T10(IO,_DIFFIO_B16n,_(DQS4B/CQ5B,DPCLK4)/(DQS4B/CQ5B,DPCLK4))
IOB4_3: U1.R11(IO,_DIFFIO_B17p,_(DQ5B)/(DQ5B))
IOB4_4: U1.T11(IO,_DIFFIO_B17n)
IOB4_5: U1.R12(IO,_DIFFIO_B18p,_(DQ5B)/(DQ5B))
IOB4_6: U1.T12(IO,_DIFFIO_B18n,_(DQ5B)/(DQ5B))
IOB4_7: U1.P9(IO,_(DQS2B/CQ3B,DPCLK5)/(DQS2B/CQ3B,DPCLK5))  [project net bus38]
IOB4_8: U1.P11(IO,_VREFB4N0)
IOB4_9: U1.R13(IO,_DIFFIO_B20p)
IOB4_10: U1.T13(IO,_DIFFIO_B20n,_(DQ5B)/(DQ5B))
IOB4_11: U1.M10(IO,_RUP2)
IOB4_12: U1.N11(IO,_RDN2)
IOB4_13: U1.T14(IO,_DIFFIO_B23p,_(DQ5B)/(DQ5B))
IOB4_14: U1.T15(IO,_DIFFIO_B23n,_(DQS0B/CQ1B,CDPCLK3)/(DQS0B/CQ1B,CDPCLK3))
IOB4_15: U1.N12(IO,_DIFFIO_B24p)  [project net add0]
IOB4_16: U1.P14(IO,_PLL4_CLKOUTp)  [project net add1]
IOB4_17: U1.R14(IO,_PLL4_CLKOUTn)
IOB5_0: U1.N14(IO,_RUP3,_(DM1R/BWS#1R)/(_))  [project net add2]
IOB5_1: U1.P15(IO,_RDN3,_(DQ1R)/(_))
IOB5_2: U1.P16(IO,_DIFFIO_R15n,_(DQS3R/CQ3R#,CDPCLK4)/(DQS3R/CQ3R#,CDPCLK4))
IOB5_3: U1.R16(IO,_DIFFIO_R15p,_(DQ1R)/(_))
IOB5_4: U1.N16(IO,_DIFFIO_R13n,_(DQ1R)/(_))
IOB5_5: U1.N15(IO,_DIFFIO_R13p,_(DQ1R)/(_))
IOB5_6: U1.L14(IO,_VREFB5N0)
IOB5_7: U1.L13(IO,_DIFFIO_R12p,_(DQ1R)/(_))  [project net add3]
IOB5_8: U1.L16(IO,_DIFFIO_R11n,_(DQ1R)/(_))
IOB5_9: U1.L15(IO,_DIFFIO_R11p)
IOB5_10: U1.K16(IO,_DIFFIO_R10n,_(DQ1R)/(_))
IOB5_11: U1.K15(IO,_DIFFIO_R10p,_(DQS1R/CQ1R#,DPCLK6)/(DQS1R/CQ1R#,DPCLK6))
IOB5_12: U1.J16(IO,_DIFFIO_R9n,_(DEV_OE))
IOB5_13: U1.J15(IO,_DIFFIO_R9p,_(DEV_CLRn))
IOB5_14: U1.J14(IO,_DIFFIO_R8n,_(DQ1R)/(_))
IOB5_15: U1.J13(IO,_DIFFIO_R7n,_(DQ1R)/(_))
IOB6_0: U1.G16(IO,_DIFFIO_R5n,_(INIT_DONE))
IOB6_1: U1.G15(IO,_DIFFIO_R5p,_(CRC_ERROR))
IOB6_2: U1.F13(IO)
IOB6_3: U1.F16(IO,_DIFFIO_R4n,_(nCEO))
IOB6_4: U1.F15(IO,_DIFFIO_R4p,_(CLKUSR))
IOB6_5: U1.B16(IO,_(DQS0R/CQ1R,DPCLK7)/(DQS0R/CQ1R,DPCLK7))
IOB6_6: U1.F14(IO,_VREFB6N0)
IOB6_7: U1.D16(IO)
IOB6_8: U1.D15(IO,_(PADD23))
IOB6_9: U1.C16(IO,_DIFFIO_R1n,_(PADD20),_(DQS2R/CQ3R,CDPCLK5)/(DQS2R/CQ3R,CDPCLK5))
IOB6_10: U1.C15(IO,_DIFFIO_R1p)
IOB7_0: U1.C14(IO,_DIFFIO_T24n)
IOB7_1: U1.D14(IO,_DIFFIO_T24p,_(DQ5T)/(DQ5T))
IOB7_2: U1.D11(IO,_DIFFIO_T23n)
IOB7_3: U1.D12(IO,_DIFFIO_T23p,_(DQS0T/CQ1T,CDPCLK6)/(DQS0T/CQ1T,CDPCLK6))
IOB7_4: U1.A13(IO,_DIFFIO_T22n)
IOB7_5: U1.B13(IO,_DIFFIO_T22p,_(DQ5T)/(DQ5T))
IOB7_6: U1.A14(IO,_PLL2_CLKOUTn)
IOB7_7: U1.B14(IO,_PLL2_CLKOUTp)
IOB7_8: U1.E11(IO,_RUP4)
IOB7_9: U1.E10(IO,_RDN4)
IOB7_10: U1.A12(IO,_DIFFIO_T21n,_(DQ5T)/(DQ5T))
IOB7_11: U1.B12(IO,_DIFFIO_T21p,_(DQ5T)/(DQ5T))
IOB7_12: U1.A11(IO,_DIFFIO_T20n,_(DQ5T)/(DQ5T))
IOB7_13: U1.B11(IO,_DIFFIO_T20p,_(PADD0),_(DQ5T)/(DQ5T))
IOB7_14: U1.C11(IO,_VREFB7N0)
IOB7_15: U1.A15(IO,_DIFFIO_T19n,_(PADD1))
IOB7_16: U1.F9(IO,_DIFFIO_T17p,_(PADD4),_(DQS2T/CQ3T,DPCLK8)/(DQS2T/CQ3T,DPCLK8))
IOB7_17: U1.A10(IO,_DIFFIO_T16n,_(PADD5),_(DQ5T)/(DQ5T))
IOB7_18: U1.B10(IO,_DIFFIO_T16p,_(PADD6),_(DQ5T)/(DQ5T))
IOB7_19: U1.C9(IO,_DIFFIO_T15n,_(PADD7),_(DQ5T)/(DQ5T))
IOB7_20: U1.D9(IO,_DIFFIO_T15p,_(PADD8),_(DM5T/BWS#5T)/(DM5T/BWS#5T))
IOB7_21: U1.E9(IO,_DIFFIO_T13p,_(PADD12),_(DQS4T/CQ5T,DPCLK9)/(DQS4T/CQ5T,DPCLK9))
IOB8_0: U1.C8(IO,_DIFFIO_T11p,_(PADD17),_(DQS5T/CQ5T#,DPCLK10)/(DQS5T/CQ5T#,DPCLK10))
IOB8_1: U1.D8(IO,_(DQ3T)/(DQ5T))
IOB8_2: U1.E8(IO,_DIFFIO_T10n,_(DATA2),_(DQ3T)/(DQ5T))
IOB8_3: U1.F8(IO,_DIFFIO_T10p,_(DATA3))
IOB8_4: U1.A7(IO,_DIFFIO_T9n,_(PADD18),_(DQ3T)/(DQ5T))
IOB8_5: U1.B7(IO,_DIFFIO_T9p,_(DATA4),_(DQ3T)/(DQ5T))
IOB8_6: U1.C6(IO,_VREFB8N0)
IOB8_7: U1.A6(IO,_DIFFIO_T7n,_(DATA14),_(DQS3T/CQ3T#,DPCLK11)/(DQS3T/CQ3T#,DPCLK11))
IOB8_8: U1.B6(IO,_DIFFIO_T7p,_(DATA13),_(DQ3T)/(DQ5T))
IOB8_9: U1.E7(IO,_(DATA5),_(DQ3T)/(DQ5T))
IOB8_10: U1.E6(IO,_DIFFIO_T6p,_(DATA6),_(DQ3T)/(DQ5T))
IOB8_11: U1.A5(IO,_DIFFIO_T5n,_(DATA7),_(DQ3T)/(DQ5T))
IOB8_12: U1.B5(IO,_DIFFIO_T5p,_(DATA8),_(DQ3T)/(DQ5T))
IOB8_13: U1.D6(IO,_DIFFIO_T4n,_(DATA9))  [project net bus17]
IOB8_14: U1.A4(IO,_DIFFIO_T3n,_(DATA10),_(DM3T/BWS#3T)/(DM5T/BWS#5T))
IOB8_15: U1.B4(IO,_DIFFIO_T3p,_(DATA11))
IOB8_16: U1.A2(IO,_DIFFIO_T2n)
IOB8_17: U1.A3(IO,_DIFFIO_T2p)
IOB8_18: U1.D5(IO)  [project net bus16]
IOB8_19: U1.B3(IO,_(DATA12),_(DQS1T/CQ1T#,CDPCLK7)/(DQS1T/CQ1T#,CDPCLK7))
IOB8_20: U1.C3(IO,_PLL3_CLKOUTn)  [project net bus19]
IOB8_21: U1.D3(IO,_PLL3_CLKOUTp)  [project net bus18]
nCE: P2.6 R7.1 R19.2 U1.J3(nCE)
nCS: C14.1 D4.1(A) P2.8 U1.D2(IO,_DIFFIO_L4p,_(FLASH_nCE,nCSO)) U2.1(nCS)
SYNC_CLK: U1.A9(CLK8,_DIFFCLK_5n) ; port SYNC_CLK
NetP1_1: P1.1 R4.1 U1.H3(TCK)
NetP1_3: P1.3 R5.1 U1.J4(TDO)
NetP1_5: P1.5 U1.J5(TMS)
NetP1_9: P1.9 R6.1 U1.H4(TDI)
NetR1_1: R1.1 U1.F4(nSTATUS)
NetU1_T8: U1.T8(CLK14,_DIFFCLK_6n) U25.OUT

Not connected (* = marked no-connect by the designer): P1 7 8

### Buses and harness runs
bus IOB1_[8..0] = port IOB1_[8..0]
bus IOB2_[13..0] = port IOB2_[13..0]
bus IOB3_[22..0] = port IOB3_[22..0]
bus IOB4_[17..0] = port IOB4_[17..0]
bus IOB5_[15..0] = port IOB5_[15..0]
bus IOB6_[10..0] = port IOB6_[10..0]
bus IOB7_[21..0] = port IOB7_[21..0]
bus IOB8_[21..0] = port IOB8_[21..0]

### Notes on the sheet
- (in symbol EP4CE22F17C8, part A) BANK 1
- (in symbol EP4CE22F17C8, part B) BANK 2
- (in symbol EP4CE22F17C8, part C) BANK 3
- (in symbol EP4CE22F17C8, part D) BANK 4
- (in symbol EP4CE22F17C8, part E) BANK 5
- (in symbol EP4CE22F17C8, part F) BANK 6
- (in symbol EP4CE22F17C8, part G) BANK 7
- (in symbol EP4CE22F17C8, part H) BANK 8

### Library data of the parts
C1-C21 C82 C89-C93 = Cap Semi: Capacitor (Semiconductor SIM Model); Published: 8-Jun-2000; LatestRevisionDate: 29-May-2009; LatestRevisionNote: IPC-7351 Footprint Added.; PackageReference: C1206; Publisher: Altium Limited; PackageDescription: Chip Capacitor
D1-D4 = Diode: Default Diode; Published: 8-Jun-2000; LatestRevisionDate: 17-Jul-2002; LatestRevisionNote: Re-released for DXP Platform.; PackageVersion: Sep-1996; PackageReference: SMC; Publisher: Altium Limited; Code_JEDEC: DO-214-AB
P1 P2 = Header 5X2: Header, 5-Pin, Dual row; LatestRevisionDate: 17-Jul-2002; LatestRevisionNote: Re-released for DXP Platform.; Publisher: Altium Limited
R1-R7 R19 = Res3: Resistor; Published: 8-Jun-2000; LatestRevisionDate: 29-May-2009; LatestRevisionNote: IPC-7351 Footprint Added.; PackageReference: J1-0603; Publisher: Altium Limited; PackageDescription: Chip Resistor
U1 = EP4CE22F17C8: Cyclone IV Family FPGA, 2V Core, 153 I/O Pins, 4 PLLs, 256-Pin FBGA, Speed Grade 8, Commercial Grade; Published: 3-May-2010; DatasheetVersion: ver1.2, Mar-2010; PackageVersion: ver16.0, Dec-2009; PackageReference: FBGA256; Publisher: Altium Limited; PackageDescription: 256-Ball FineLine Ball Grid Array (FBGA256) - Option 1 - Wire Bond; Supplier 1: Digi-Key; Supplier Part Number 1: EP4CE22F17C8-ND; Code_JEDEC: MS-034-AAF-1; Code_IPC: BGA100P16X16-256; ComponentLink1Description: Manufacturer Link; ComponentLink1URL: http://www.altera.com/; ComponentLink2Description: Handbook; ComponentLink2URL: http://www.altera.com/literature/hb/cyclone-iv/cyclone4-handbook.pdf; ComponentLink3Description: Pinout Specification; ComponentLink3URL: http://www.altera.com/literature/lit-dp.jsp?category=cyc%204&showspreadsheet=y; ComponentLink4Description: Packaging Specification; ComponentLink4URL: http://www.altera.com/literature/ds/dspkg.pdf
U2 = EPCS4SI8N: EPCS4 Series, In-system programmable 3.3V serial configuration device, 8-Pin SOIC, 4-Megabit, Industrial Grade, Pb-Free; Configures: Cyclone II, Stratix II, & Cyclone Devices; Published: 4-Mar-2005; LatestRevisionDate: 13-Apr-2006; LatestRevisionNote: IPC-7351 Footprint Added.; DatasheetVersion: ver2.0, Oct-2003; PackageVersion: ver13.0, May-2005; PackageReference: SOIC8; Publisher: Altium Limited; PackageDescription: 8-Pin Small Outline Integrated Circuit Package (SOIC8); Code_JEDEC: MS-012-AA; Code_IPC: SOIC127P600-8; ComponentLink1Description: Manufacturer Link; ComponentLink1URL: http://www.altera.com/products/devices/config/cfg-index.html; ComponentLink2Description: Configuration Handbook; ComponentLink2URL: http://www.altera.com/literature/hb/cfg/config_handbook.pdf; ComponentLink3Description: Pinout Specification; ComponentLink3URL: http://www.altera.com/literature/hb/cfg/cyc_c51014.pdf; ComponentLink4Description: Packaging Specification; ComponentLink4URL: http://www.altera.com/literature/ds/dspkg.pdf
U25 = CSX750F: Clock Oscillator; pin to pad: GND>2 OE>1 OUT>3 Vdd>4

## Sheet Power_supply.SchDoc
size A4
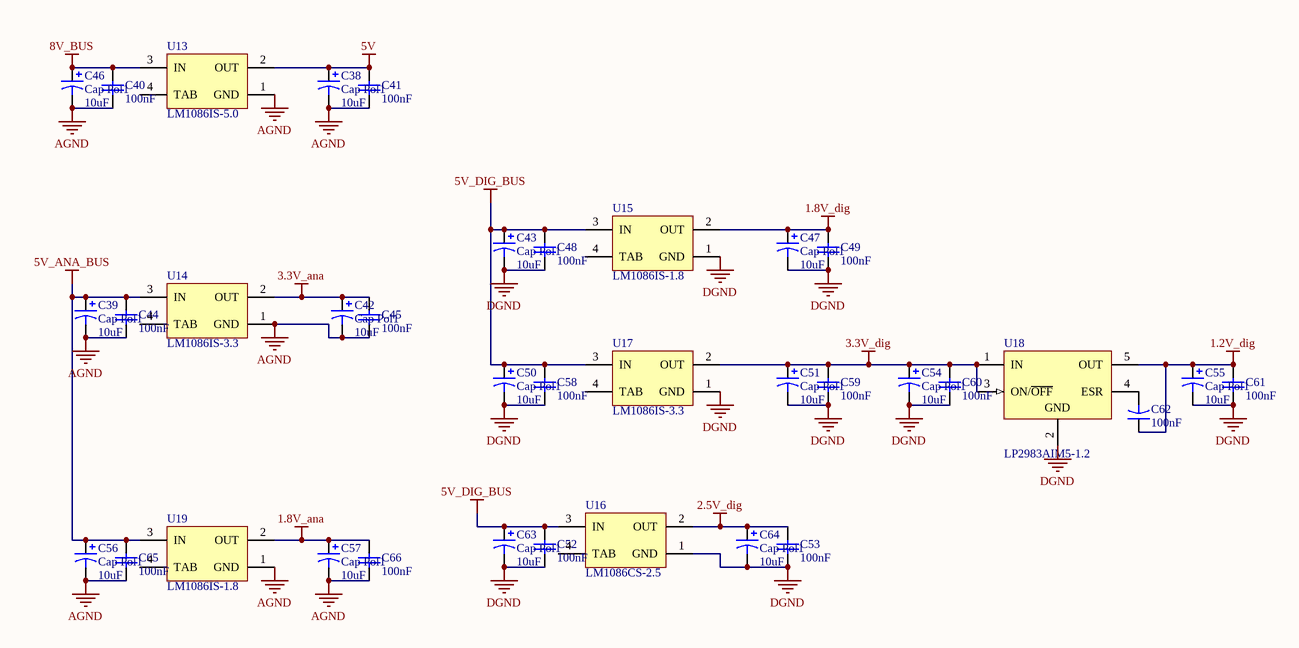
[diagram p3: Power_supply.SchDoc]

### Parts
C38  Cap Pol1  value 10uF  [B]
C39  Cap Pol1  value 10uF  [B]
C40  value 100nF  [CAPC2012L]  (hidden comment: Cap Semi)
C41  value 100nF  [CAPC2012L]  (hidden comment: Cap Semi)
C42  Cap Pol1  value 10uF  [B]
C43  Cap Pol1  value 10uF  [B]
C44  value 100nF  [CAPC2012L]  (hidden comment: Cap Semi)
C45  value 100nF  [CAPC2012L]  (hidden comment: Cap Semi)
C46  Cap Pol1  value 10uF  [B]
C47  Cap Pol1  value 10uF  [B]
C48  value 100nF  [CAPC2012L]  (hidden comment: Cap Semi)
C49  value 100nF  [CAPC2012L]  (hidden comment: Cap Semi)
C50  Cap Pol1  value 10uF  [B]
C51  Cap Pol1  value 10uF  [B]
C52  value 100nF  [CAPC2012L]  (hidden comment: Cap Semi)
C53  value 100nF  [CAPC2012L]  (hidden comment: Cap Semi)
C54  Cap Pol1  value 10uF  [B]
C55  Cap Pol1  value 10uF  [B]
C56  Cap Pol1  value 10uF  [B]
C57  Cap Pol1  value 10uF  [B]
C58  value 100nF  [CAPC2012L]  (hidden comment: Cap Semi)
C59  value 100nF  [CAPC2012L]  (hidden comment: Cap Semi)
C60  value 100nF  [CAPC2012L]  (hidden comment: Cap Semi)
C61  value 100nF  [CAPC2012L]  (hidden comment: Cap Semi)
C62  value 100nF  [CAPC2012L]  (hidden comment: Cap)
C63  Cap Pol1  value 10uF  [B]
C64  Cap Pol1  value 10uF  [B]
C65  value 100nF  [CAPC2012L]  (hidden comment: Cap Semi)
C66  value 100nF  [CAPC2012L]  (hidden comment: Cap Semi)
U13  LM1086IS-5.0  [TS3B_N]
U14  LM1086IS-3.3  [TS3B_N]
U15  LM1086IS-1.8  [TS3B_N]
U16  LM1086CS-2.5  [TS3B_N]
U17  LM1086IS-3.3  [TS3B_N]
U18  LP2983AIM5-1.2  [MF05A_N]
U19  LM1086IS-1.8  [TS3B_N]

### Nets
1.2V_dig: C55.1 C61.2 C62.1 U18.5(OUT)
1.8V_ana: C57.1 C66.2 U19.2(OUT)
1.8V_dig: C47.1 C49.2 U15.2(OUT)
2.5V_dig: C53.2 C64.1 U16.2(OUT)
3.3V_ana: C42.1 C45.2 U14.2(OUT)
3.3V_dig: C51.1 C54.1 C59.2 C60.2 U17.2(OUT) U18.1(IN) U18.3(ON/~{OFF})
5V: C38.1 C41.2 U13.2(OUT)
5V_ANA_BUS: C39.1 C44.2 C56.1 C65.2 U14.3(IN) U19.3(IN)
5V_DIG_BUS: C43.1 C48.2 C50.1 C52.2 C58.2 C63.1 U15.3(IN) U16.3(IN) U17.3(IN)
8V_BUS: C40.2 C46.1 U13.3(IN)
AGND: C38.2 C39.2 C40.1 C41.1 C42.2 C43.2 C44.1 C45.1 C46.2 C47.2 C48.1 C49.1 C50.2 C51.2 C52.1 C53.1 C54.2 C55.2 C56.2 C57.2 C58.1 C59.1 C60.1 C61.1 C63.2 C64.2 C65.1 C66.1 U13.1(GND) U14.1(GND) U15.1(GND) U16.1(GND) U17.1(GND) U18.2(GND) U19.1(GND)  [also labelled DGND]
NetC62_2: C62.2 U18.4(ESR)

Not connected (* = marked no-connect by the designer): U13 4(TAB); U14 4(TAB); U15 4(TAB); U16 4(TAB); U17 4(TAB); U19 4(TAB)

### Library data of the parts
C38 C39 C42 C43 C46 C47 C50 C51 C54-C57 C63 C64 = Cap Pol1: Polarized Capacitor (Radial); Voltage: 16V; Published: 8-Jun-2000; LatestRevisionDate: 17-Jul-2002; LatestRevisionNote: Re-released for DXP Platform.; PackageReference: RB7.6-15; Publisher: Altium Limited
C40 C41 C44 C45 C48 C49 C52 C53 C58-C61 C65 C66 = Cap Semi: Capacitor (Semiconductor SIM Model); Published: 8-Jun-2000; LatestRevisionDate: 29-May-2009; LatestRevisionNote: IPC-7351 Footprint Added.; PackageReference: C1206; Publisher: Altium Limited; PackageDescription: Chip Capacitor
C62 = Cap2: Capacitor; Published: 23-Sep-2002; PackageReference: CAPR5-4X5; Publisher: Altium Limited
U13 = LM1086IS-5.0: 1.5A Low Dropout Positive Regulators; Manufacturer: National Semiconductor; CompType: LDO IC; PackageTopMarking: NSUZXYTTE#*LM1086*IS-5.0; PowerWise: N; Published: 4-Dec-2008; DatasheetVersion: Jun-2005; PackageVersion: revF, Apr-2005; PackageReference: TS3B; Publisher: Altium Limited; PackageDescription: TO-263, Molded, .400 x .390 x .180in, 3 Lead, .1in Pitch, Surface Mount; PartNumber: LM1086IS-5.0; RoHS: O; PinCount: 3; DigiKeyPartNumber: LM1086IS-5.0-ND; Code_JEDEC: MO-169-AA; ComponentLink1Description: LM1086 Datasheet; ComponentLink1URL: http://www.national.com/ds/LM/LM1086.pdf; ComponentLink2Description: LM1086 Web Page; ComponentLink2URL: http://www.national.com/pf/LM/LM1086.html; ComponentLink3Description: TS3B Package Page; ComponentLink3URL: http://www.national.com/packaging/folders/ts3b.html
U14 U16 U17 = LM1086IS-3.3: 1.5A Low Dropout Positive Regulators; Manufacturer: National Semiconductor; CompType: LDO IC; PackageTopMarking: NSUZXYTTE#*LM1086*IS-3.3; PowerWise: N; Published: 4-Dec-2008; DatasheetVersion: Jun-2005; PackageVersion: revF, Apr-2005; PackageReference: TS3B; Publisher: Altium Limited; PackageDescription: TO-263, Molded, .400 x .390 x .180in, 3 Lead, .1in Pitch, Surface Mount; PartNumber: LM1086IS-3.3; RoHS: O; PinCount: 3; DigiKeyPartNumber: LM1086IS-3.3-ND; Code_JEDEC: MO-169-AA; ComponentLink1Description: LM1086 Datasheet; ComponentLink1URL: http://www.national.com/ds/LM/LM1086.pdf; ComponentLink2Description: LM1086 Web Page; ComponentLink2URL: http://www.national.com/pf/LM/LM1086.html; ComponentLink3Description: TS3B Package Page; ComponentLink3URL: http://www.national.com/packaging/folders/ts3b.html
U15 U19 = LM1086IS-1.8: 1.5A Low Dropout Positive Regulators; Manufacturer: National Semiconductor; CompType: LDO IC; PackageTopMarking: NSUZXYTTE#*LM1086*IS-1.8; PowerWise: N; Published: 4-Dec-2008; DatasheetVersion: Jun-2005; PackageVersion: revF, Apr-2005; PackageReference: TS3B; Publisher: Altium Limited; PackageDescription: TO-263, Molded, .400 x .390 x .180in, 3 Lead, .1in Pitch, Surface Mount; PartNumber: LM1086IS-1.8; RoHS: O; PinCount: 3; DigiKeyPartNumber: LM1086IS-1.8-ND; Code_JEDEC: MO-169-AA; ComponentLink1Description: LM1086 Datasheet; ComponentLink1URL: http://www.national.com/ds/LM/LM1086.pdf; ComponentLink2Description: LM1086 Web Page; ComponentLink2URL: http://www.national.com/pf/LM/LM1086.html; ComponentLink3Description: TS3B Package Page; ComponentLink3URL: http://www.national.com/packaging/folders/ts3b.html
U18 = LP2983AIM5-1.2: Micropower 150 mA Voltage Regulator in SOT-23 Package For Output Voltages [Less_Than_Or_Equal] 1.2V; Manufacturer: National Semiconductor; CompType: LDO IC; PackageTopMarking: LELA*XTT; PowerWise: N; Published: 4-Dec-2008; DatasheetVersion: Apr-2005; PackageVersion: revD, Aug-2008; PackageReference: MF05A; Publisher: Altium Limited; PackageDescription: Molded SOT-23, .115 x .063 x .040 in Body, 5 Lead, .0375 in Pitch; PartNumber: LP2983AIM5-1.2; RoHS: O; PinCount: 5; DigiKeyPartNumber: LP2983AIM5-1.2CT-ND; ComponentLink1Description: LP2983 Datasheet; ComponentLink1URL: http://www.national.com/ds/LP/LP2983.pdf; ComponentLink2Description: LP2983 Web Page; ComponentLink2URL: http://www.national.com/pf/LP/LP2983.html; ComponentLink3Description: MF05A Package Page; ComponentLink3URL: http://www.national.com/packaging/folders/mf05a.html

## Nets that join several sheets
1.2V_dig: cyclone4 (28 pins), Power_supply (C55.1 C61.2 C62.1 U18.5)
1.8V_ana: DDS_RIKEN_main (5 pins), Power_supply (C57.1 C66.2 U19.2)
1.8V_dig: DDS_RIKEN_main (C26.1 U3.6 U3.23 U3.73), Power_supply (C47.1 C49.2 U15.2)
2.5V_dig: cyclone4 (7 pins), Power_supply (C53.2 C64.1 U16.2)
3.3V_ana: DDS_RIKEN_main (14 pins), Power_supply (C42.1 C45.2 U14.2)
3.3V_dig: DDS_RIKEN_main (57 pins), cyclone4 (52 pins), Power_supply (7 pins)
5V: DDS_RIKEN_main (14 pins), Power_supply (C38.1 C41.2 U13.2)
5V_ANA_BUS: DDS_RIKEN_main (P3.A3 P3.B3), Power_supply (6 pins)
5V_DIG_BUS: DDS_RIKEN_main (P3.A62 P3.B62), Power_supply (9 pins)
8V_BUS: DDS_RIKEN_main (P3.A1 P3.B1), Power_supply (C40.2 C46.1 U13.3)
AGND: DDS_RIKEN_main (145 pins), cyclone4 (96 pins), Power_supply (35 pins)
add0: DDS_RIKEN_main (P4.2 R14.1), cyclone4 (U1.N12)
add1: DDS_RIKEN_main (P4.4 R16.1), cyclone4 (U1.P14)
add2: DDS_RIKEN_main (P4.6 R17.1), cyclone4 (U1.N14)
add3: DDS_RIKEN_main (P4.8 R18.1), cyclone4 (U1.L13)
bus0: DDS_RIKEN_main (U4.3), cyclone4 (U1.K1)
bus1: DDS_RIKEN_main (U4.5), cyclone4 (U1.K2)
bus2: DDS_RIKEN_main (U4.11), cyclone4 (U1.J1)
bus3: DDS_RIKEN_main (U4.13), cyclone4 (U1.J2)
bus4: DDS_RIKEN_main (U8.3), cyclone4 (U1.N1)
bus5: DDS_RIKEN_main (U8.5), cyclone4 (U1.N2)
bus6: DDS_RIKEN_main (U8.11), cyclone4 (U1.L1)
bus7: DDS_RIKEN_main (U8.13), cyclone4 (U1.L2)
bus8: DDS_RIKEN_main (U12.3), cyclone4 (U1.R1)
bus9: DDS_RIKEN_main (U12.5), cyclone4 (U1.T2)
bus10: DDS_RIKEN_main (U12.11), cyclone4 (U1.P1)
bus11: DDS_RIKEN_main (U12.13), cyclone4 (U1.P2)
bus12: DDS_RIKEN_main (U5.3), cyclone4 (U1.R4)
bus13: DDS_RIKEN_main (U5.5), cyclone4 (U1.T4)
bus14: DDS_RIKEN_main (U5.11), cyclone4 (U1.R3)
bus15: DDS_RIKEN_main (U5.13), cyclone4 (U1.T3)
bus16: DDS_RIKEN_main (U9.3), cyclone4 (U1.D5)
bus17: DDS_RIKEN_main (U9.5), cyclone4 (U1.D6)
bus18: DDS_RIKEN_main (U9.11), cyclone4 (U1.D3)
bus19: DDS_RIKEN_main (U9.13), cyclone4 (U1.C3)
bus20: DDS_RIKEN_main (U20.3), cyclone4 (U1.K5)
bus21: DDS_RIKEN_main (U20.5), cyclone4 (U1.F3)
bus22: DDS_RIKEN_main (U20.11), cyclone4 (U1.L3)
bus23: DDS_RIKEN_main (U20.13), cyclone4 (U1.L7)
bus24: DDS_RIKEN_main (U6.3), cyclone4 (U1.M6)
bus25: DDS_RIKEN_main (U6.5), cyclone4 (U1.L4)
bus26: DDS_RIKEN_main (U6.11), cyclone4 (U1.P3)
bus27: DDS_RIKEN_main (U6.13), cyclone4 (U1.N3)
bus28: DDS_RIKEN_main (U10.3), cyclone4 (U1.M7)
bus29: DDS_RIKEN_main (U10.5), cyclone4 (U1.N5)
bus30: DDS_RIKEN_main (U10.11), cyclone4 (U1.N6)
bus31: DDS_RIKEN_main (U10.13), cyclone4 (U1.P6)
bus32: DDS_RIKEN_main (U7.1), cyclone4 (U1.R6)
bus33: DDS_RIKEN_main (U7.7), cyclone4 (U1.T7)
bus34: DDS_RIKEN_main (U7.9), cyclone4 (U1.R5)
bus35: DDS_RIKEN_main (U7.15), cyclone4 (U1.T5)
bus36: DDS_RIKEN_main (U11.1), cyclone4 (U1.P8)
bus37: DDS_RIKEN_main (U11.7), cyclone4 (U1.R7)
bus38: DDS_RIKEN_main (U11.9), cyclone4 (U1.P9)
bus39: DDS_RIKEN_main (U11.15), cyclone4 (U1.N8)
IOB1_0: DDS_RIKEN_main (U3.66), cyclone4 (U1.B1)
IOB1_1: DDS_RIKEN_main (U3.65), cyclone4 (U1.C2)
IOB1_3: DDS_RIKEN_main (U3.64), cyclone4 (U1.D1)
IOB1_4: DDS_RIKEN_main (U21.8), cyclone4 (U1.G5)
IOB1_6: DDS_RIKEN_main (U3.63), cyclone4 (U1.F1)
IOB3_15: DDS_RIKEN_main (U7.4), cyclone4 (U1.T6)
IOB3_19: DDS_RIKEN_main (U21.7), cyclone4 (U1.L8)
IOB3_20: DDS_RIKEN_main (U11.4), cyclone4 (U1.M8)
IOB4_0: DDS_RIKEN_main (U23.4), cyclone4 (U1.N9)
IOB4_8: DDS_RIKEN_main (U23.2), cyclone4 (U1.P11)
IOB4_11: DDS_RIKEN_main (U23.3), cyclone4 (U1.M10)
IOB4_12: DDS_RIKEN_main (U23.13), cyclone4 (U1.N11)
IOB5_1: DDS_RIKEN_main (U3.31), cyclone4 (U1.P15)
IOB5_4: DDS_RIKEN_main (U3.30), cyclone4 (U1.N16)
IOB5_5: DDS_RIKEN_main (U3.29), cyclone4 (U1.N15)
IOB5_6: DDS_RIKEN_main (U21.28), cyclone4 (U1.L14)
IOB5_8: DDS_RIKEN_main (U3.28), cyclone4 (U1.L16)
IOB5_9: DDS_RIKEN_main (U3.27), cyclone4 (U1.L15)
IOB5_10: DDS_RIKEN_main (U3.26), cyclone4 (U1.K16)
IOB5_11: DDS_RIKEN_main (U3.25), cyclone4 (U1.K15)
IOB5_12: DDS_RIKEN_main (U3.22), cyclone4 (U1.J16)
IOB5_13: DDS_RIKEN_main (U3.21), cyclone4 (U1.J15)
IOB5_14: DDS_RIKEN_main (U21.2), cyclone4 (U1.J14)
IOB5_15: DDS_RIKEN_main (U21.1), cyclone4 (U1.J13)
IOB6_0: DDS_RIKEN_main (U3.20), cyclone4 (U1.G16)
IOB6_1: DDS_RIKEN_main (U3.19), cyclone4 (U1.G15)
IOB6_2: DDS_RIKEN_main (U21.4), cyclone4 (U1.F13)
IOB6_3: DDS_RIKEN_main (U3.18), cyclone4 (U1.F16)
IOB6_4: DDS_RIKEN_main (U3.15), cyclone4 (U1.F15)
IOB6_5: DDS_RIKEN_main (U3.10), cyclone4 (U1.B16)
IOB6_6: DDS_RIKEN_main (U21.3), cyclone4 (U1.F14)
IOB6_7: DDS_RIKEN_main (U3.14), cyclone4 (U1.D16)
IOB6_8: DDS_RIKEN_main (U3.13), cyclone4 (U1.D15)
IOB6_9: DDS_RIKEN_main (U3.12), cyclone4 (U1.C16)
IOB6_10: DDS_RIKEN_main (U3.11), cyclone4 (U1.C15)
IOB7_0: DDS_RIKEN_main (U21.6), cyclone4 (U1.C14)
IOB7_1: DDS_RIKEN_main (U21.5), cyclone4 (U1.D14)
IOB7_4: DDS_RIKEN_main (U3.4), cyclone4 (U1.A13)
IOB7_5: DDS_RIKEN_main (U3.3), cyclone4 (U1.B13)
IOB7_6: DDS_RIKEN_main (U3.8), cyclone4 (U1.A14)
IOB7_7: DDS_RIKEN_main (U3.5), cyclone4 (U1.B14)
IOB7_10: DDS_RIKEN_main (U3.2), cyclone4 (U1.A12)
IOB7_11: DDS_RIKEN_main (U3.1), cyclone4 (U1.B12)
IOB7_12: DDS_RIKEN_main (U3.88), cyclone4 (U1.A11)
IOB7_13: DDS_RIKEN_main (U3.87), cyclone4 (U1.B11)
IOB7_15: DDS_RIKEN_main (U3.9), cyclone4 (U1.A15)
IOB7_17: DDS_RIKEN_main (U3.86), cyclone4 (U1.A10)
IOB7_18: DDS_RIKEN_main (U3.85), cyclone4 (U1.B10)
IOB8_0: DDS_RIKEN_main (U3.81), cyclone4 (U1.C8)
IOB8_1: DDS_RIKEN_main (U21.11), cyclone4 (U1.D8)
IOB8_2: DDS_RIKEN_main (U21.10), cyclone4 (U1.E8)
IOB8_3: DDS_RIKEN_main (U21.9), cyclone4 (U1.F8)
IOB8_4: DDS_RIKEN_main (U3.79), cyclone4 (U1.A7)
IOB8_5: DDS_RIKEN_main (U3.80), cyclone4 (U1.B7)
IOB8_6: DDS_RIKEN_main (U21.14), cyclone4 (U1.C6)
IOB8_7: DDS_RIKEN_main (U3.77), cyclone4 (U1.A6)
IOB8_8: DDS_RIKEN_main (U3.78), cyclone4 (U1.B6)
IOB8_9: DDS_RIKEN_main (U21.12), cyclone4 (U1.E7)
IOB8_10: DDS_RIKEN_main (U21.13), cyclone4 (U1.E6)
IOB8_11: DDS_RIKEN_main (U3.75), cyclone4 (U1.A5)
IOB8_12: DDS_RIKEN_main (U3.76), cyclone4 (U1.B5)
IOB8_14: DDS_RIKEN_main (U3.71), cyclone4 (U1.A4)
IOB8_15: DDS_RIKEN_main (U3.72), cyclone4 (U1.B4)
IOB8_16: DDS_RIKEN_main (U3.68), cyclone4 (U1.A2)
IOB8_17: DDS_RIKEN_main (U3.69), cyclone4 (U1.A3)
IOB8_19: DDS_RIKEN_main (U3.70), cyclone4 (U1.B3)
SYNC_CLK: DDS_RIKEN_main (U3.82), cyclone4 (U1.A9)